# EAGLE design transponder-5.2 (EAGLE 9.6.1)

## Sheet 1 of 7
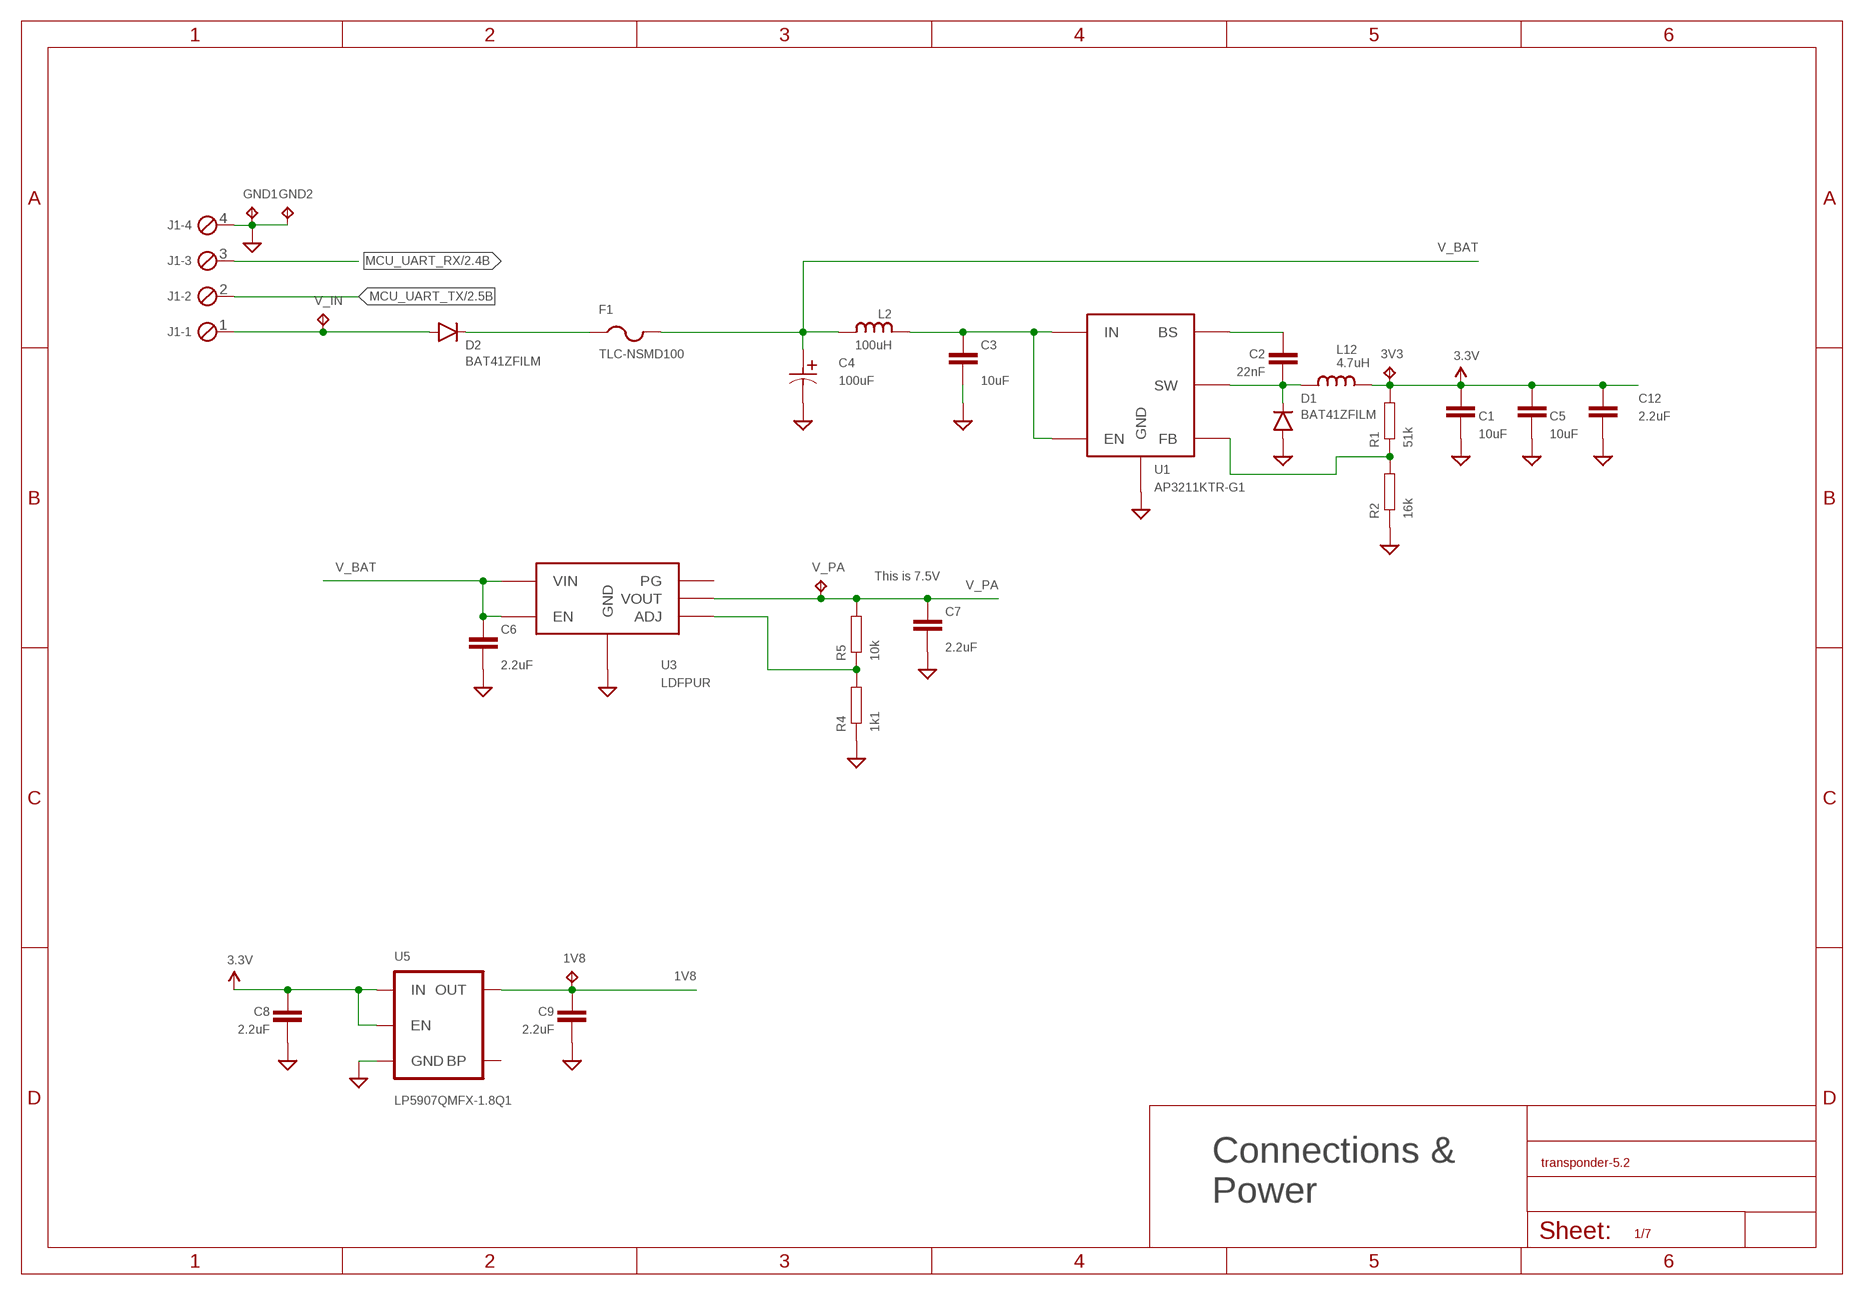
[diagram p0: schematic, sheet 1]

### Parts
1V8  TPTP16R  [TP16R]
3V3  TPTP16R  [TP16R]
C1  10uF  CAP0805  [0805]
C2  22nF  CAP0603-CAP  [0603-CAP]
C3  10uF  CAP0805  [0805]
C4  100uF  UWX1C101MCL1GB  [PCAP_6.3X5.4-ELECT]
C5  10uF  CAP0805  [0805]
C6  2.2uF  CAP0603-CAP  [0603-CAP]
C7  2.2uF  CAP0603-CAP  [0603-CAP]
C8  2.2uF  CAP0603-CAP  [0603-CAP]
C9  2.2uF  CAP0603-CAP  [0603-CAP]
C12  2.2uF  CAP0603-CAP  [0603-CAP]
D1  BAT41ZFILM  DIODESOD123  [SOD-123]
D2  BAT41ZFILM  DIODESOD123  [SOD-123]
F1  TLC-NSMD100  PTCFUSE-1206  [R1206]
GND1  TPTP16R  [TP16R]
GND2  TPTP16R  [TP16R]
J1  MPT4  [4POL254]
L2  100uH  INDUCTOR1206  [1206]
L12  4.7uH  INDUCTOR0805  [0805]
R1  51k  RESISTOR0603-RES  [0603-RES]
R2  16k  RESISTOR0603-RES  [0603-RES]
R4  1k1  RESISTOR0603-RES  [0603-RES]
R5  10k  RESISTOR0603-RES  [0603-RES]
U1  AP3211KTR-G1  AP3211  [SOT23-6]
U3  LDFPUR  LDF  [DFN-6]
U5  LP5907QMFX-1.8Q1  V_REG_LDOSMD  [SOT23-5]
V_IN  TPTP16R  [TP16R]
V_PA  TPTP16R  [TP16R]

### Nets
1V8: 1V8.TP C9.1 U5.5(OUT) ; also sheet 6
3.3V: 3V3.TP C1.1 C5.1 C8.1 C12.1 L12.P$2 R1.2 U5.1(IN) U5.3(EN) ; also sheet 2,4,6,7
GND: C1.2 C3.2 C4.2 C5.2 C6.2 C7.2 C8.2 C9.2 C12.2 D1.A GND1.TP GND2.TP J1.4 R2.1 R4.1 U1.2(GND) U3.P$4(GND) U3.P$7(GND) U5.2(GND) ; also sheet 2,3,4,5,6,7
MCU_UART_RX: J1.3 ; also sheet 2
MCU_UART_TX: J1.2 ; also sheet 2
N$1: C3.1 L2.P$1 U1.4(EN) U1.5(IN)
N$2: C2.2 D1.C L12.P$1 U1.6(SW)
N$4: C2.1 U1.1(BS)
N$5: R1.1 R2.2 U1.3(FB)
N$9: R4.2 R5.1 U3.P$2(ADJ)
N$22: D2.C F1.1
V_BAT: C4.1 C6.1 F1.2 L2.P$2 U3.P$5(EN) U3.P$6(VIN)
V_IN: D2.A J1.1 V_IN.TP
V_PA: C7.1 R5.2 U3.P$1(VOUT) V_PA.TP ; also sheet 5
Unconnected: U3.P$3(PG) U5.4(BP)

### Notes on the sheet
- This is 7.5V
- Connections &
  Power

## Sheet 2 of 7
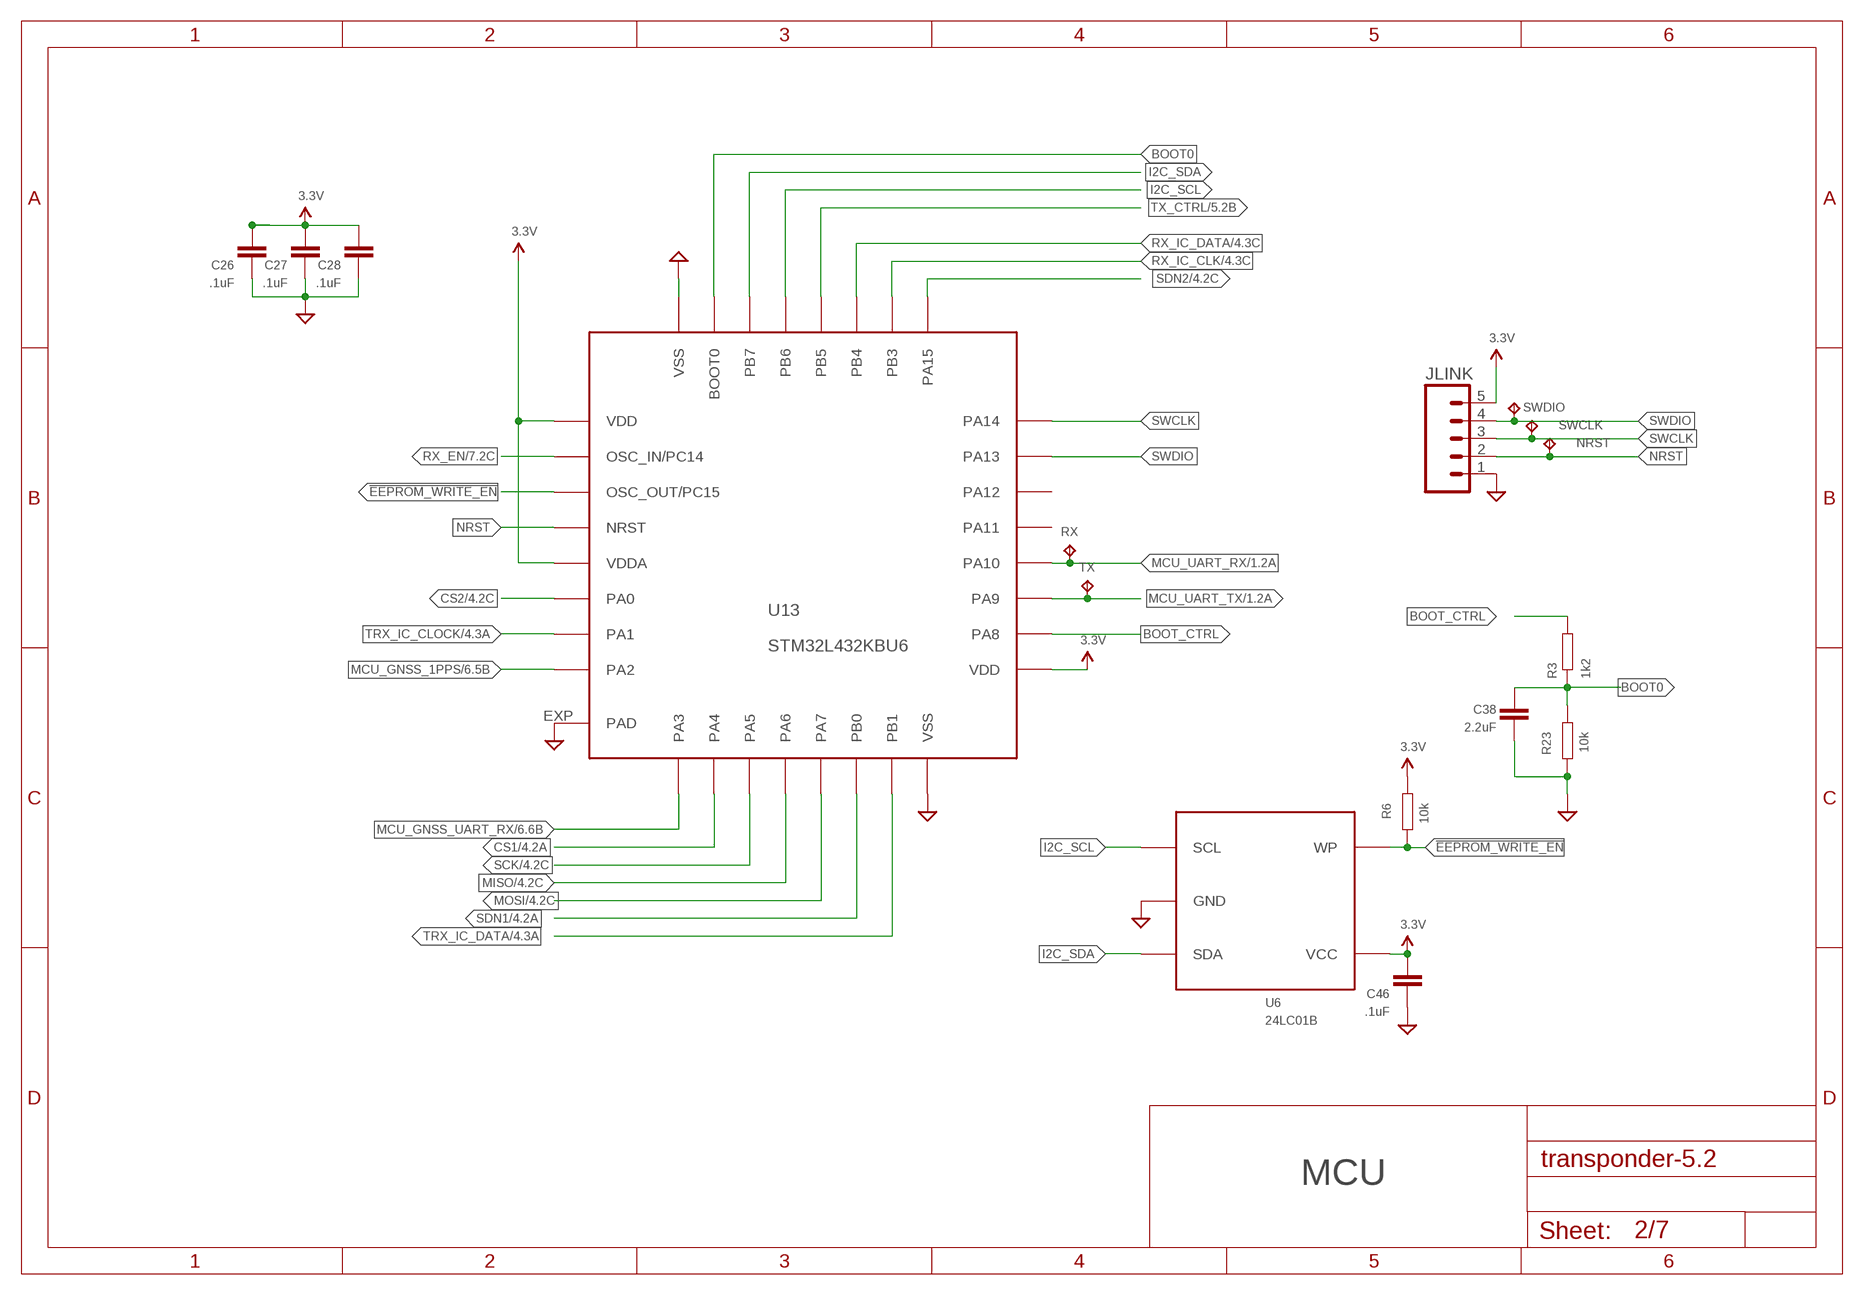
[diagram p1: schematic, sheet 2]

### Parts
C26  .1uF  CAP0603-CAP  [0603-CAP]
C27  .1uF  CAP0603-CAP  [0603-CAP]
C28  .1uF  CAP0603-CAP  [0603-CAP]
C38  2.2uF  CAP0603-CAP  [0603-CAP]
C46  .1uF  CAP0603-CAP  [0603-CAP]
JLINK  M05PTH  [1X05]
NRST  TPTP16R  [TP16R]
R3  1k2  RESISTOR0603-RES  [0603-RES]
R6  10k  RESISTOR0603-RES  [0603-RES]
R23  10k  RESISTOR0603-RES  [0603-RES]
RX  TPTP16R  [TP16R]
SWCLK  TPTP16R  [TP16R]
SWDIO  TPTP16R  [TP16R]
TX  TPTP16R  [TP16R]
U6  24LC01B  [SOT23-5]
U13  STM32L432KBU6  STM32L432KXXX  [QFN32]

### Nets
3.3V: C26.1 C27.1 C28.1 C46.1 JLINK.5 R6.1 U6.4(VCC) U13.1(VDD) U13.5(VDDA) U13.17(VDD) ; also sheet 1,4,6,7
!EEPROM_WRITE_EN: R6.2 U6.5(WP) U13.3(OSC_OUT/PC15)
BOOT0: C38.1 R3.1 R23.1 U13.31(BOOT0)
BOOT_CTRL: R3.2 U13.18(PA8)
CS1: U13.10(PA4) ; also sheet 4
CS2: U13.6(PA0) ; also sheet 4
GND: C26.2 C27.2 C28.2 C38.2 C46.2 JLINK.1 R23.2 U6.2(GND) U13.16(VSS) U13.32(VSS) U13.EXP(PAD) ; also sheet 1,3,4,5,6,7
I2C_SCL: U6.1(SCL) U13.29(PB6)
I2C_SDA: U6.3(SDA) U13.30(PB7)
MCU_GNSS_1PPS: U13.8(PA2) ; also sheet 6
MCU_GNSS_UART_RX: U13.9(PA3) ; also sheet 6
MCU_UART_RX: RX.TP U13.20(PA10) ; also sheet 1
MCU_UART_TX: TX.TP U13.19(PA9) ; also sheet 1
MISO: U13.12(PA6) ; also sheet 4
MOSI: U13.13(PA7) ; also sheet 4
NRST: JLINK.2 NRST.TP U13.4(NRST)
RX_EN: U13.2(OSC_IN/PC14) ; also sheet 7
RX_IC_CLK: U13.26(PB3) ; also sheet 4
RX_IC_DATA: U13.27(PB4) ; also sheet 4
SCK: U13.11(PA5) ; also sheet 4
SDN1: U13.14(PB0) ; also sheet 4
SDN2: U13.25(PA15) ; also sheet 4
SWCLK: JLINK.3 SWCLK.TP U13.24(PA14)
SWDIO: JLINK.4 SWDIO.TP U13.23(PA13)
TRX_IC_CLOCK: U13.7(PA1) ; also sheet 4
TRX_IC_DATA: U13.15(PB1) ; also sheet 4
TX_CTRL: U13.28(PB5) ; also sheet 5
Unconnected: U13.21(PA11) U13.22(PA12)

### Notes on the sheet
- MCU

## Sheet 3 of 7
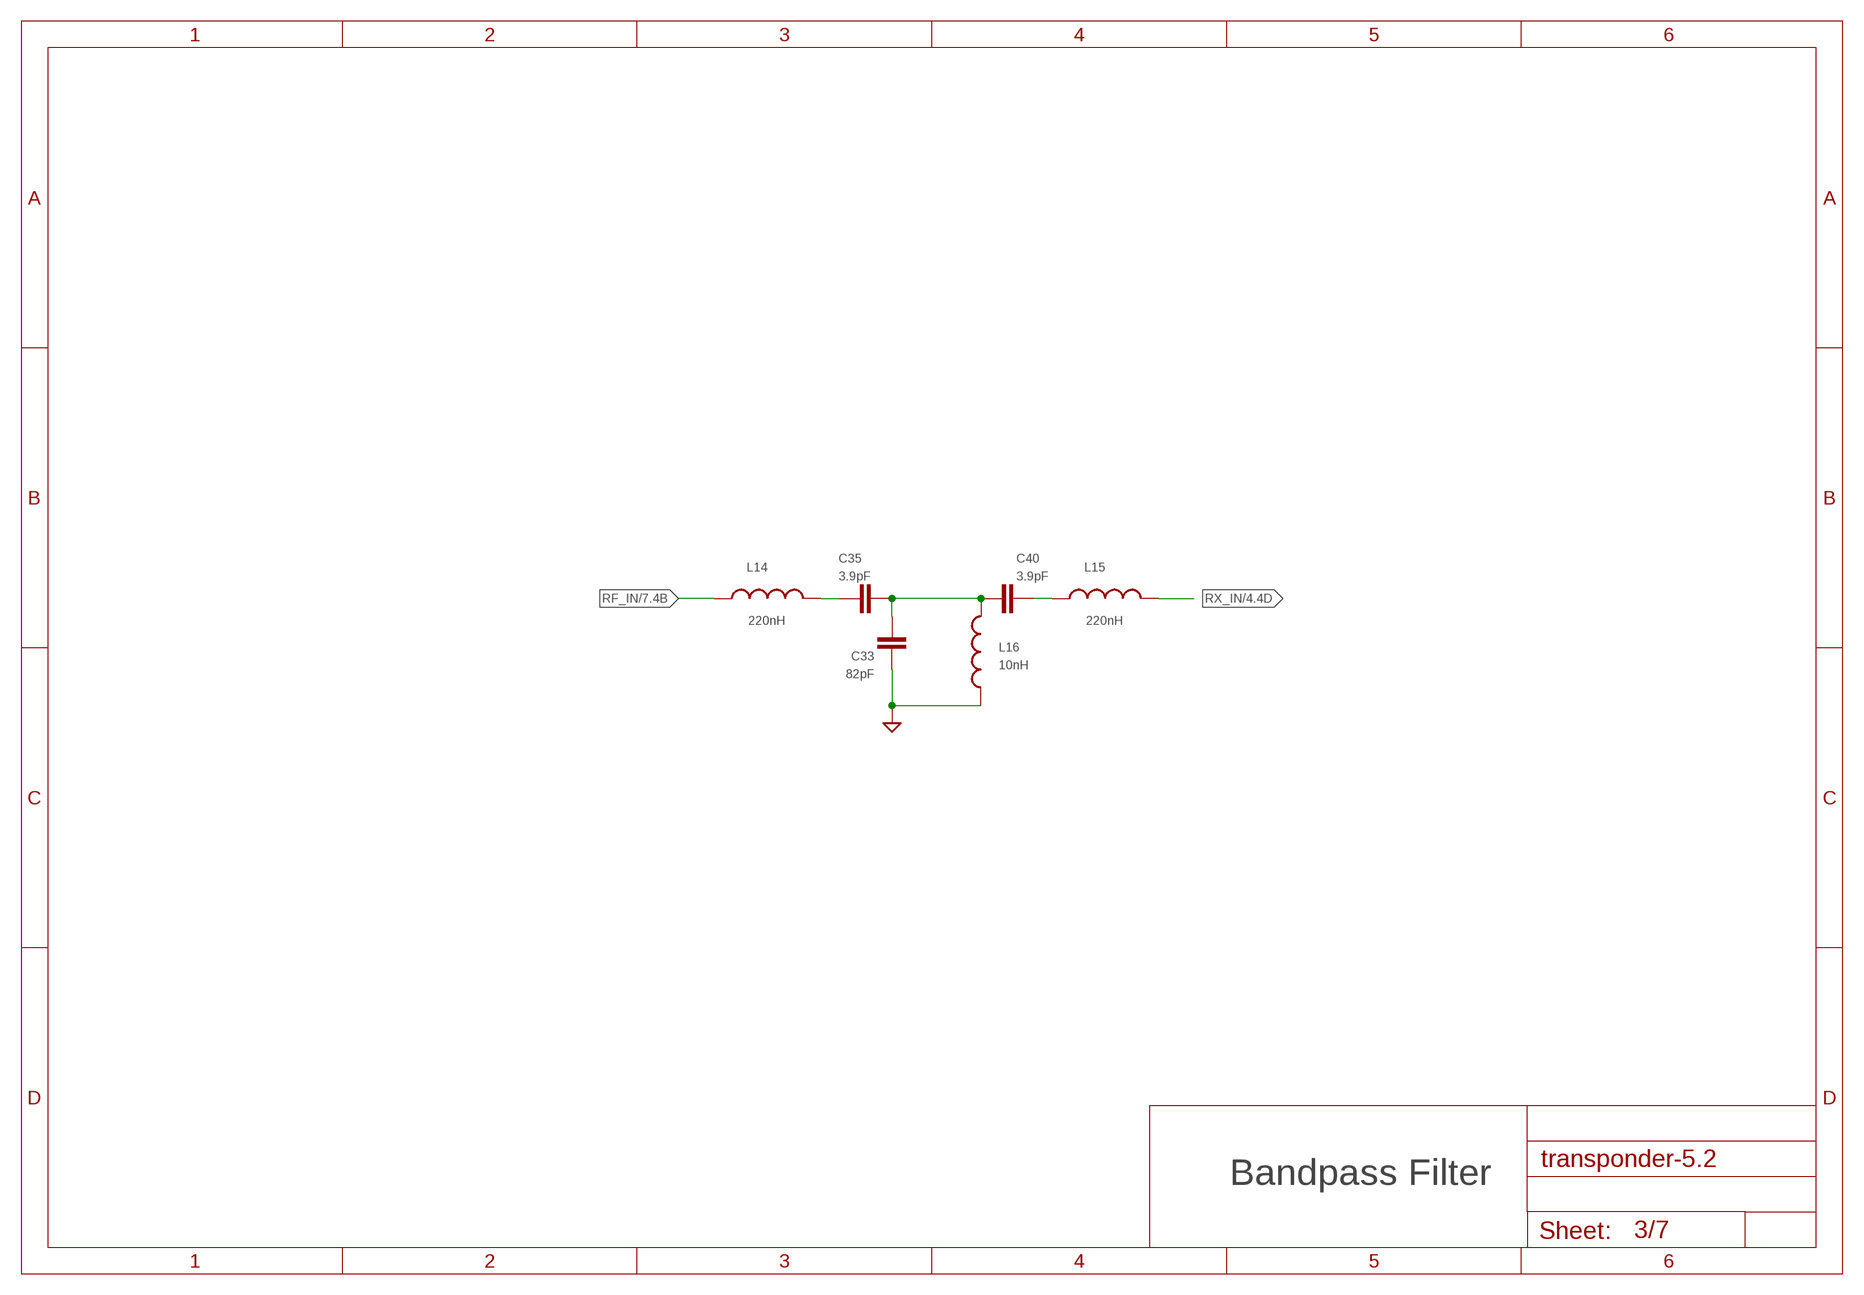
[diagram p2: schematic, sheet 3]

### Parts
C33  82pF  CAP0603-CAP  [0603-CAP]
C35  3.9pF  CAP0603-CAP  [0603-CAP]
C40  3.9pF  CAP0603-CAP  [0603-CAP]
L14  220nH  INDUCTOR0603  [0603]
L15  220nH  INDUCTOR0603  [0603]
L16  10nH  INDUCTOR0603  [0603]

### Nets
GND: C33.1 L16.1 ; also sheet 1,2,4,5,6,7
N$37: C33.2 C35.1 C40.2 L16.2
N$38: C40.1 L15.1
N$39: C35.2 L14.2
RF_IN: L14.1 ; also sheet 7
RX_IN: L15.2 ; also sheet 4

### Notes on the sheet
- Bandpass Filter

## Sheet 4 of 7
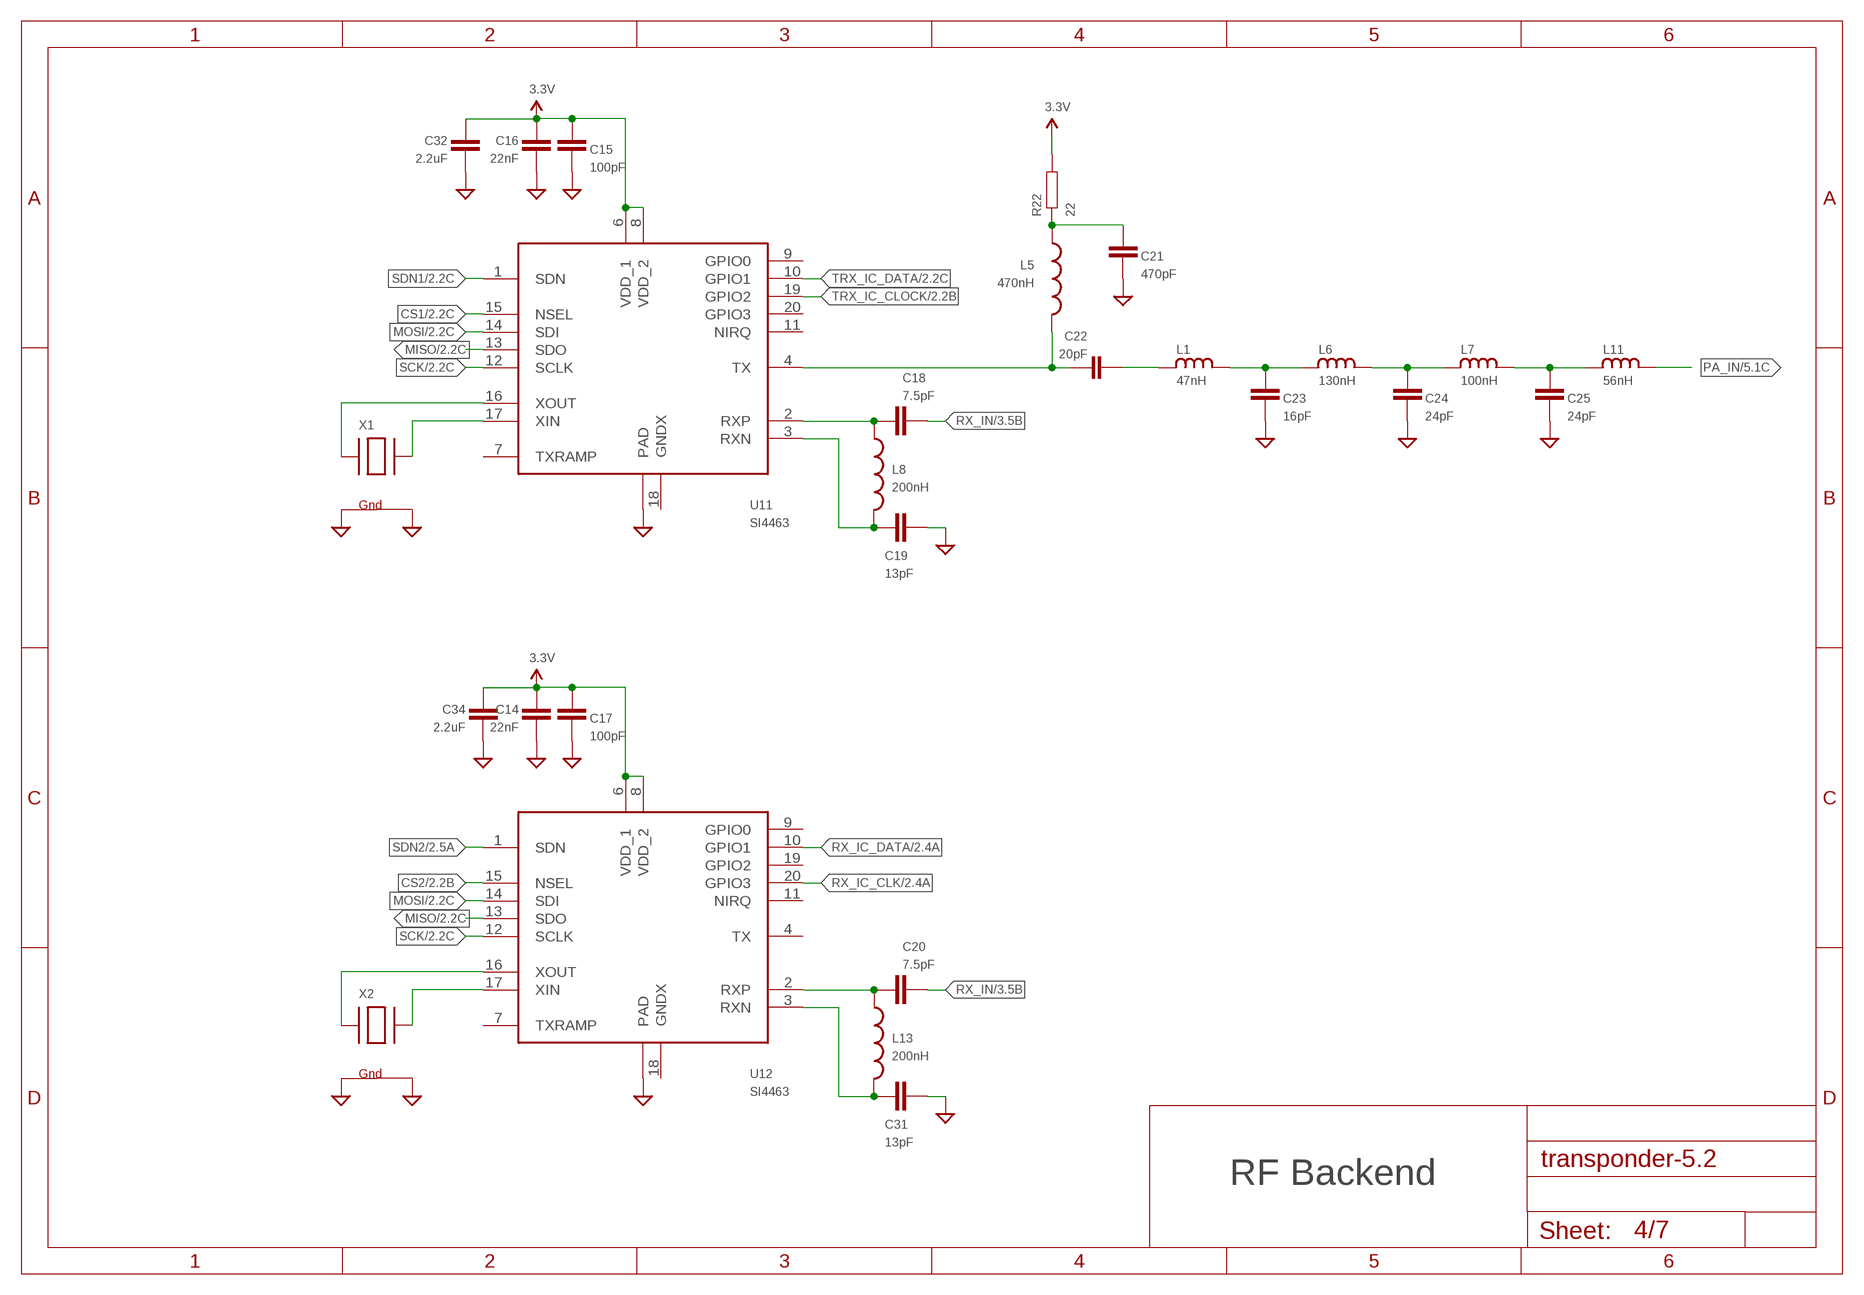
[diagram p3: schematic, sheet 4]

### Parts
C14  22nF  CAP0603-CAP  [0603-CAP]
C15  100pF  CAP0603-CAP  [0603-CAP]
C16  22nF  CAP0603-CAP  [0603-CAP]
C17  100pF  CAP0603-CAP  [0603-CAP]
C18  7.5pF  CAP0603-CAP  [0603-CAP]
C19  13pF  CAP0603-CAP  [0603-CAP]
C20  7.5pF  CAP0603-CAP  [0603-CAP]
C21  470pF  CAP0603-CAP  [0603-CAP]
C22  20pF  CAPACITOR0603  [0603]
C23  16pF  CAP0603-CAP  [0603-CAP]
C24  24pF  CAP0603-CAP  [0603-CAP]
C25  24pF  CAP0603-CAP  [0603-CAP]
C31  13pF  CAP0603-CAP  [0603-CAP]
C32  2.2uF  CAP0603-CAP  [0603-CAP]
C34  2.2uF  CAP0603-CAP  [0603-CAP]
L1  47nH  INDUCTOR0603  [0603]
L5  470nH  INDUCTOR0603  [0603]
L6  130nH  INDUCTOR0603  [0603]
L7  100nH  INDUCTOR0603  [0603]
L8  200nH  INDUCTOR0603  [0603]
L11  56nH  INDUCTOR0603  [0603]
L13  200nH  INDUCTOR0603  [0603]
R22  22  RESISTOR0603-RES  [0603-RES]
U11  SI4463  [SI4463]
U12  SI4463  [SI4463]
X1  XTAL-4-3225  [NX3225]
X2  XTAL-4-3225  [NX3225]

### Nets
3.3V: C14.1 C15.1 C16.1 C17.1 C32.1 C34.1 R22.2 U11.6(VDD_1) U11.8(VDD_2) U12.6(VDD_1) U12.8(VDD_2) ; also sheet 1,2,6,7
CS1: U11.15(NSEL) ; also sheet 2
CS2: U12.15(NSEL) ; also sheet 2
GND: C14.2 C15.2 C16.2 C17.2 C19.1 C21.2 C23.2 C24.2 C25.2 C31.1 C32.2 C34.2 U11.EXP(PAD) U12.EXP(PAD) X1.2(G2) X1.4(G1) X2.2(G2) X2.4(G1) ; also sheet 1,2,3,5,6,7
MISO: U11.13(SDO) U12.13(SDO) ; also sheet 2
MOSI: U11.14(SDI) U12.14(SDI) ; also sheet 2
N$3: C19.2 L8.2 U11.3(RXN)
N$6: C18.1 L8.1 U11.2(RXP)
N$7: C24.1 L6.P$2 L7.P$1
N$11: C25.1 L7.P$2 L11.P$1
N$12: C23.1 L1.P$2 L6.P$1
N$16: U12.16(XOUT) X2.1(X1)
N$17: U12.17(XIN) X2.3(X2)
N$18: U11.16(XOUT) X1.1(X1)
N$19: U11.17(XIN) X1.3(X2)
N$20: C20.1 L13.1 U12.2(RXP)
N$21: C31.2 L13.2 U12.3(RXN)
N$24: C22.P$1 L5.2 U11.4(TX)
N$30: C21.1 L5.1 R22.1
N$31: C22.P$2 L1.P$1
PA_IN: L11.P$2 ; also sheet 5
RX_IC_CLK: U12.20(GPIO3) ; also sheet 2
RX_IC_DATA: U12.10(GPIO1) ; also sheet 2
RX_IN: C18.2 C20.2 ; also sheet 3
SCK: U11.12(SCLK) U12.12(SCLK) ; also sheet 2
SDN1: U11.1(SDN) ; also sheet 2
SDN2: U12.1(SDN) ; also sheet 2
TRX_IC_CLOCK: U11.19(GPIO2) ; also sheet 2
TRX_IC_DATA: U11.10(GPIO1) ; also sheet 2
Unconnected: U11.7(TXRAMP) U11.9(GPIO0) U11.11(NIRQ) U11.18(GNDX) U11.20(GPIO3) U12.4(TX) U12.7(TXRAMP) U12.9(GPIO0) U12.11(NIRQ) U12.18(GNDX) U12.19(GPIO2)

### Notes on the sheet
- RF Backend

## Sheet 5 of 7
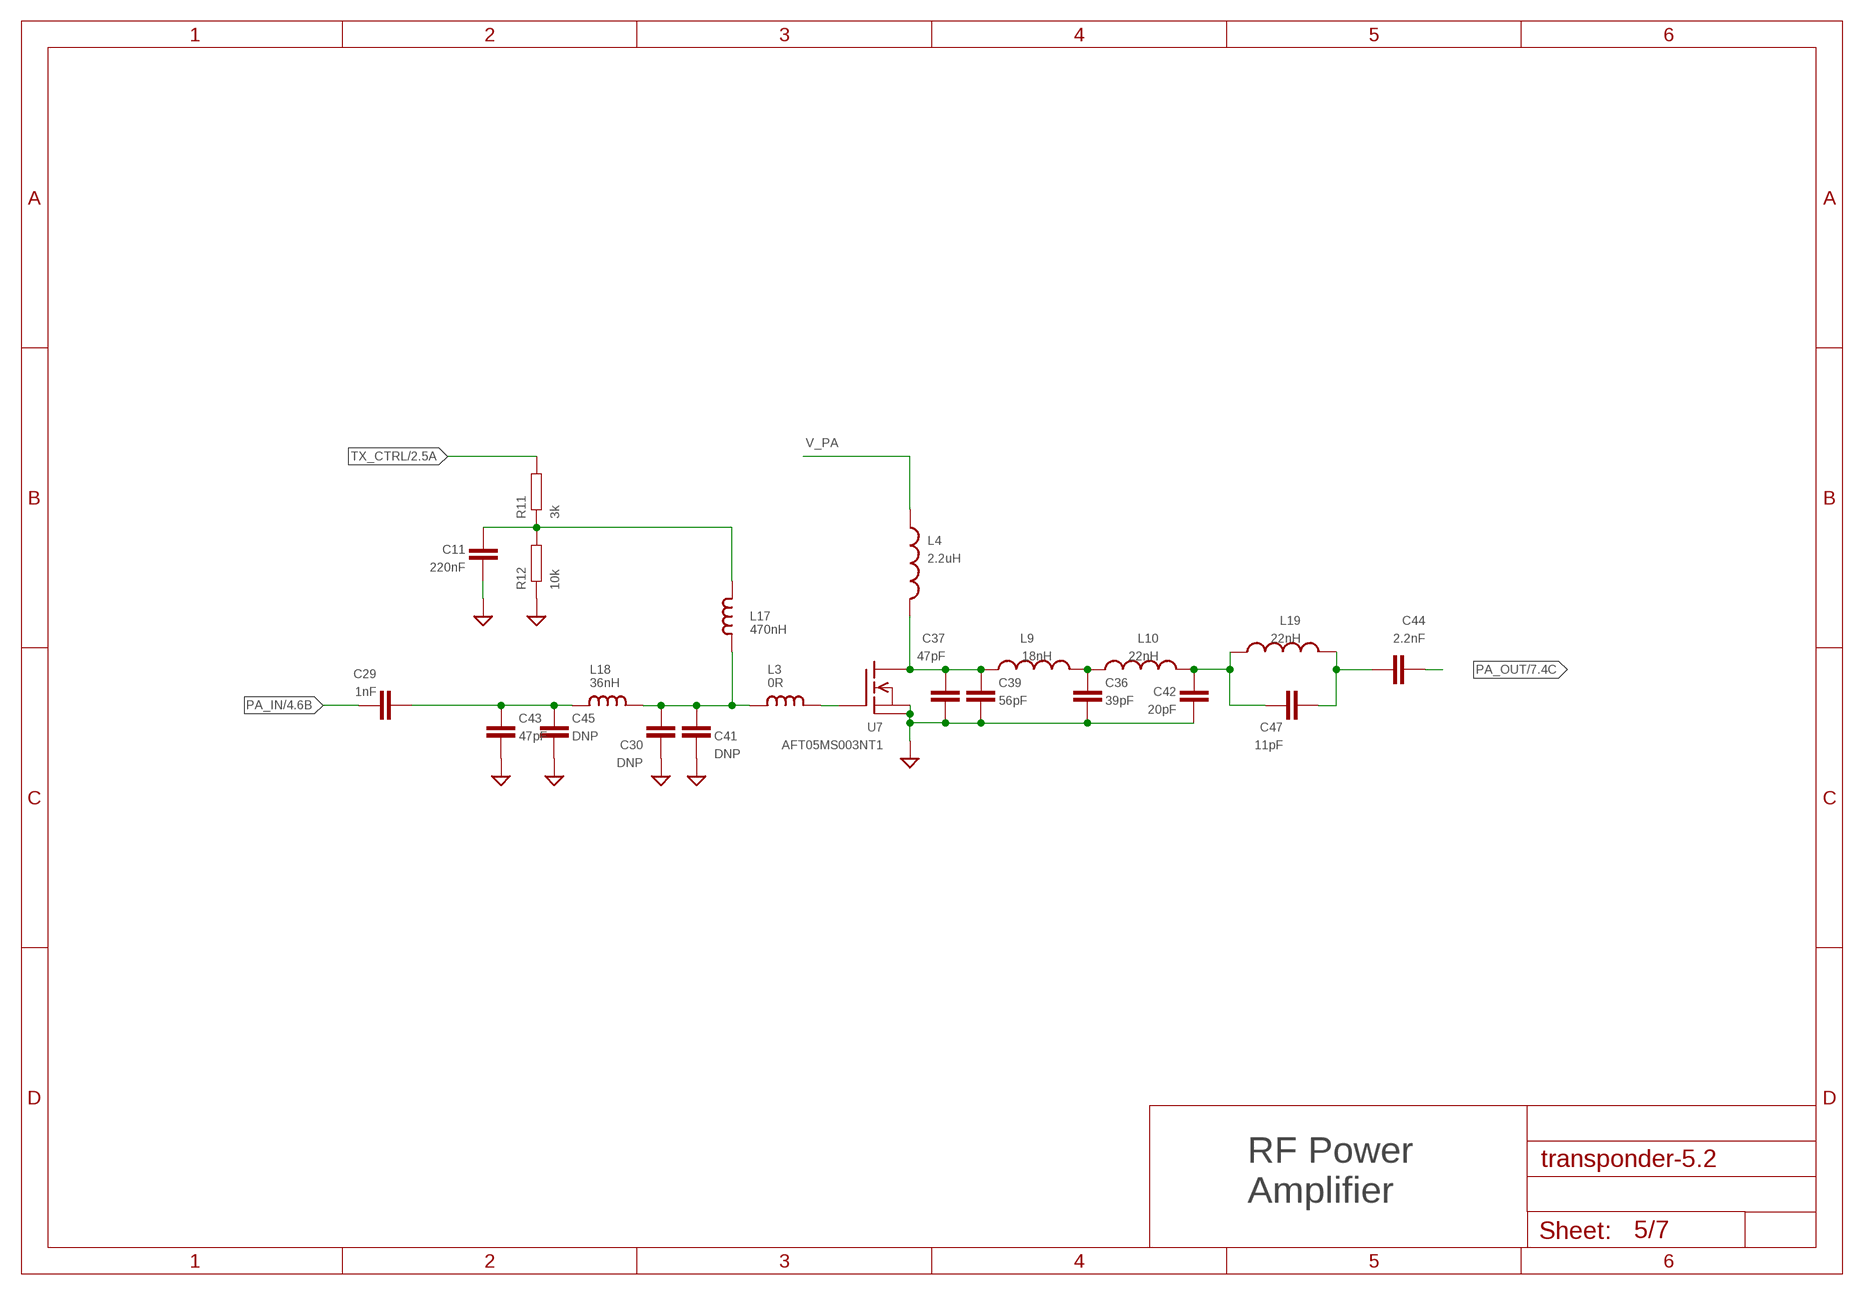
[diagram p4: schematic, sheet 5]

### Parts
C11  220nF  CAP0603-CAP  [0603-CAP]
C29  1nF  CAP0603-CAP  [0603-CAP]
C30  DNP  CAP0603-CAP  [0603-CAP]
C36  39pF  CAP0603-CAP  [0603-CAP]
C37  47pF  CAP0603-CAP  [0603-CAP]
C39  56pF  CAP0603-CAP  [0603-CAP]
C41  DNP  CAP0603-CAP  [0603-CAP]
C42  20pF  CAP0603-CAP  [0603-CAP]
C43  47pF  CAP0603-CAP  [0603-CAP]
C44  2.2nF  CAP0603-CAP  [0603-CAP]
C45  DNP  CAP0603-CAP  [0603-CAP]
C47  11pF  CAP0603-CAP  [0603-CAP]
L3  0R  INDUCTOR0603  [0603]
L4  2.2uH  INDUCTOR0805  [0805]
L9  18nH  INDUCTOR0603  [0603]
L10  22nH  INDUCTOR0603  [0603]
L17  470nH  INDUCTOR0603  [0603]
L18  36nH  INDUCTOR0603  [0603]
L19  22nH  INDUCTOR0603  [0603]
R11  3k  RESISTOR0603-RES  [0603-RES]
R12  10k  RESISTOR0603-RES  [0603-RES]
U7  AFT05MS003NT1  AFT0SMS003N  [SOT-89]

### Nets
GND: C11.2 C30.2 C36.2 C37.2 C39.2 C41.2 C42.2 C43.2 C45.2 R12.1 U7.2(S) U7.2@1(PAD) ; also sheet 1,2,3,4,6,7
N$8: C11.1 L17.P$2 R11.1 R12.2
N$23: C37.1 C39.1 L4.2 L9.1 U7.3(D)
N$26: L3.P$2 U7.1(G)
N$28: C36.1 L9.2 L10.1
N$29: C29.2 C43.1 C45.1 L18.P$1
N$32: C30.1 C41.1 L3.P$1 L17.P$1 L18.P$2
N$34: C44.1 C47.2 L19.2
N$43: C42.1 C47.1 L10.2 L19.1
PA_IN: C29.1 ; also sheet 4
PA_OUT: C44.2 ; also sheet 7
TX_CTRL: R11.2 ; also sheet 2
V_PA: L4.1 ; also sheet 1

### Notes on the sheet
- RF Power
  Amplifier

## Sheet 6 of 7
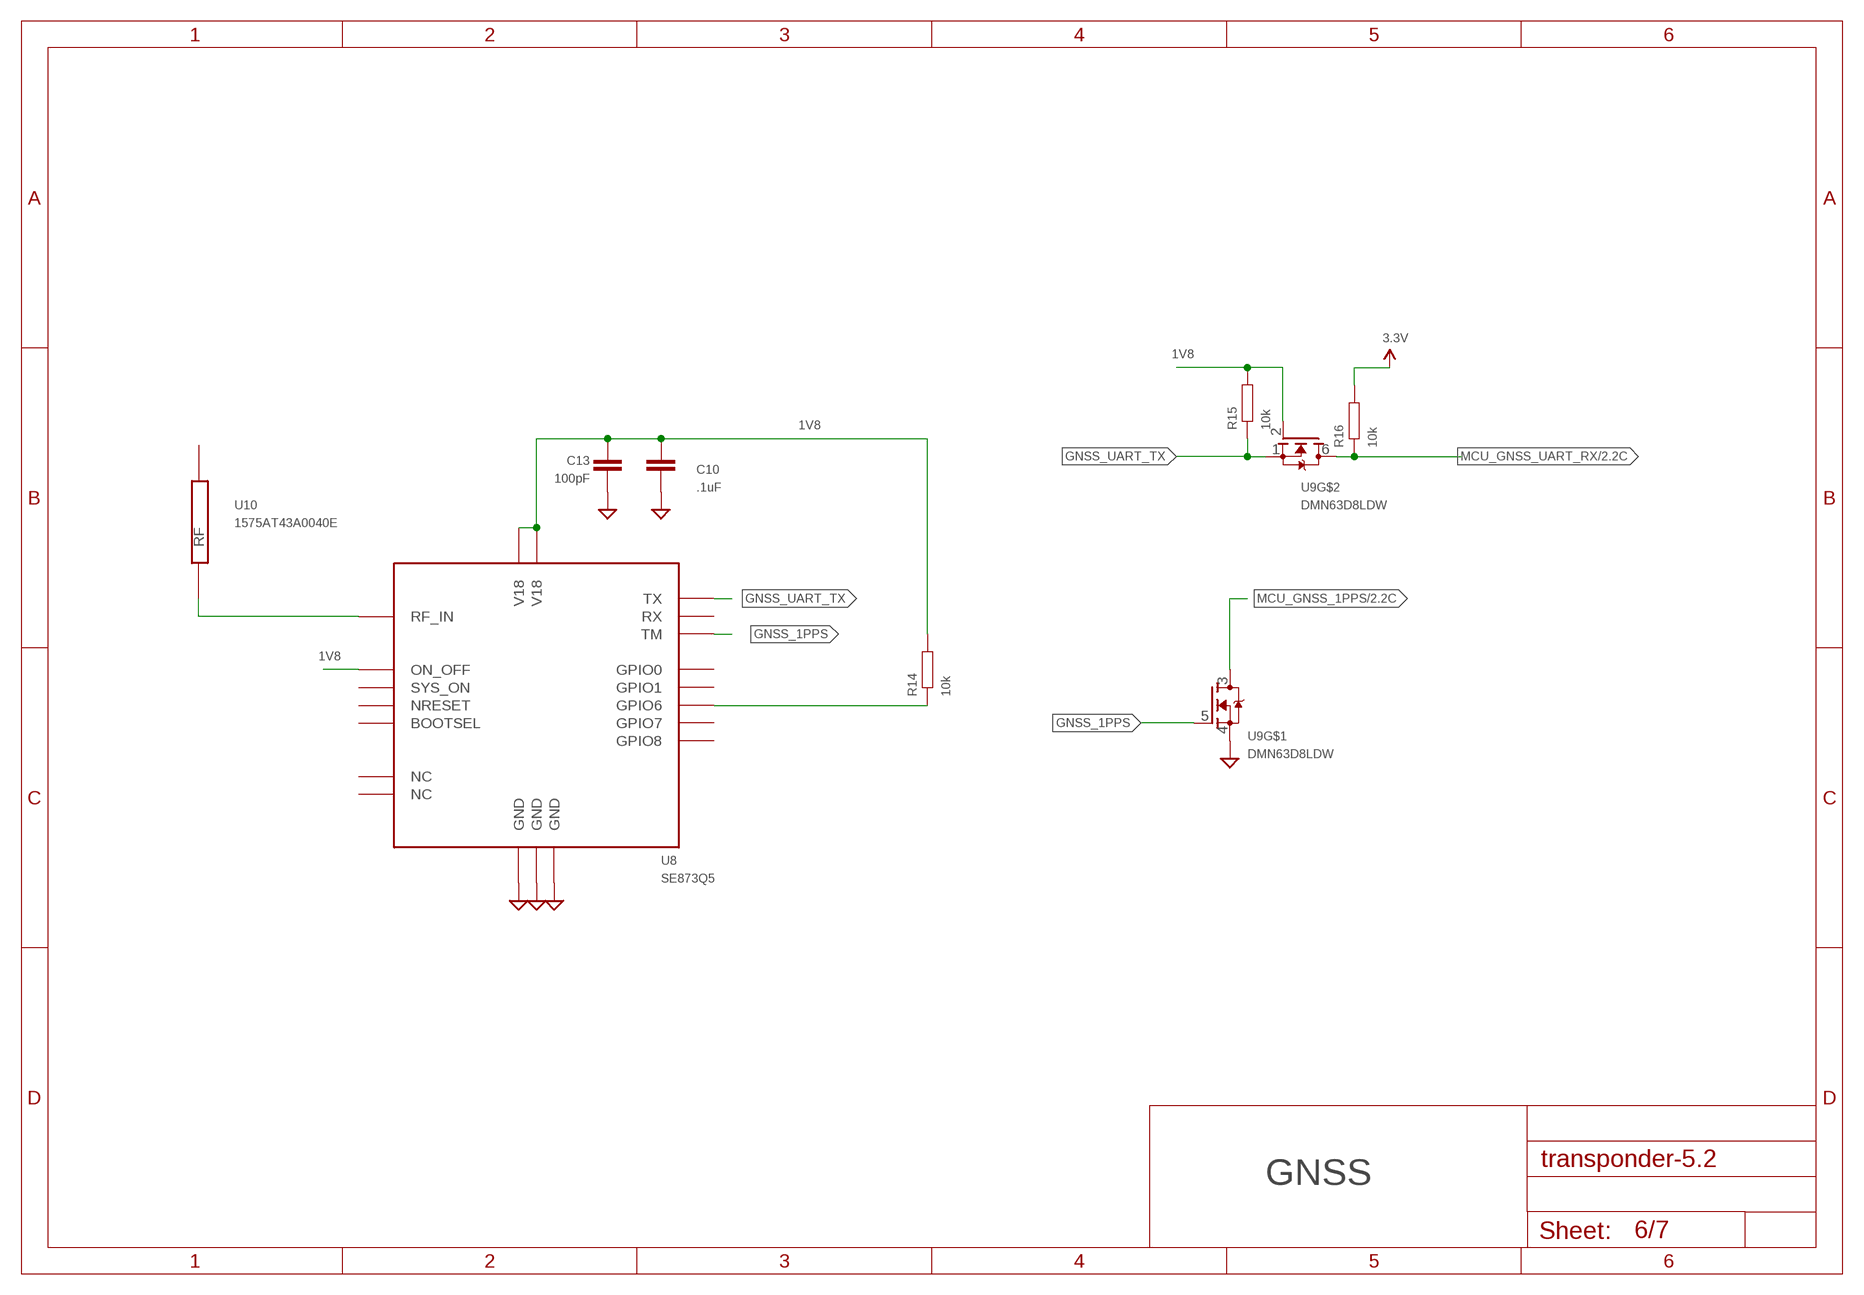
[diagram p5: schematic, sheet 6]

### Parts
C10  .1uF  CAP0603-CAP  [0603-CAP]
C13  100pF  CAP0603-CAP  [0603-CAP]
R14  10k  RESISTOR0603-RES  [0603-RES]
R15  10k  RESISTOR0603-RES  [0603-RES]
R16  10k  RESISTOR0603-RES  [0603-RES]
U8  SE873Q5  SE873  [SE873]
U9  DMN63D8LDW  [SOT363]
U10  1575AT43A0040E  [1575AT43A0040E]

### Nets
1V8: C10.1 C13.1 R14.2 R15.2 U8.P$3(V18) U8.P$6(ON_OFF) U8.P$19(V18) U9.2(G) ; also sheet 1
3.3V: R16.2 ; also sheet 1,2,4,7
GND: C10.2 C13.2 U8.P$2(GND) U8.P$10(GND) U8.P$20(GND) U9.4(S) ; also sheet 1,2,3,4,5,7
GNSS_1PPS: U8.P$11(TM) U9.5(G)
GNSS_UART_TX: R15.1 U8.P$15(TX) U9.1(S)
MCU_GNSS_1PPS: U9.3(D) ; also sheet 2
MCU_GNSS_UART_RX: R16.1 U9.6(D) ; also sheet 2
N$10: U8.P$1(RF_IN) U10.P$1(RF)
N$13: R14.1 U8.P$13(GPIO6)
Unconnected: U8.P$4(NC) U8.P$5(GPIO8) U8.P$7(SYS_ON) U8.P$8(NRESET) U8.P$9(BOOTSEL) U8.P$12(GPIO7) U8.P$14(RX) U8.P$16(NC) U8.P$17(GPIO1) U8.P$18(GPIO0) U10.P$2(PAD)

### Notes on the sheet
- GNSS

## Sheet 7 of 7
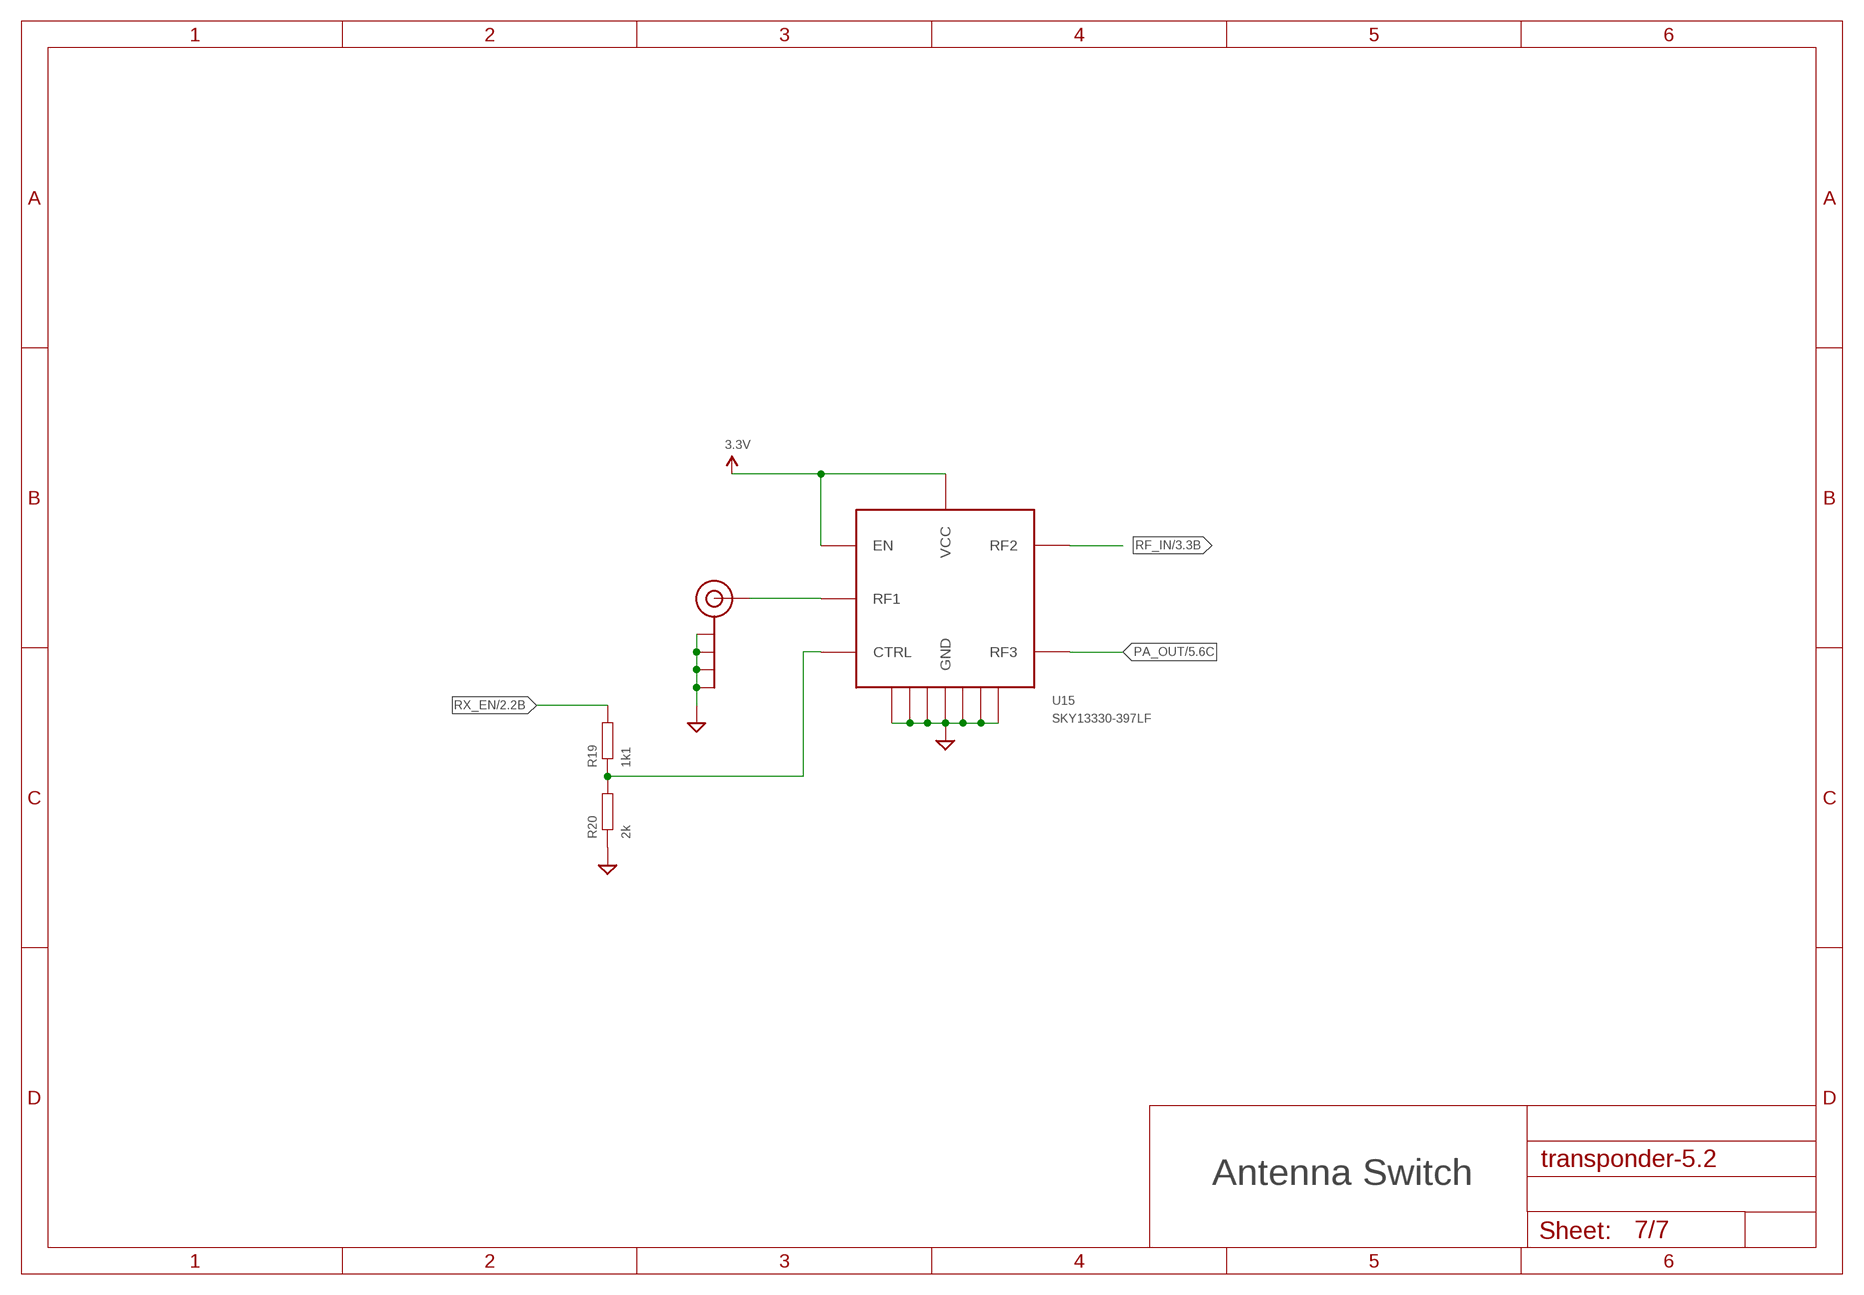
[diagram p6: schematic, sheet 7]

### Parts
J$1  SMA_EDGE  [SMA-EDGE]
R19  1k1  RESISTOR0603-RES  [0603-RES]
R20  2k  RESISTOR0603-RES  [0603-RES]
U15  SKY13330-397LF  SKYWORKS-13330397LF  [QFN12]

### Nets
3.3V: U15.P$8(EN) U15.P$9(VCC) ; also sheet 1,2,4,6
GND: J$1.GND@0(GND) J$1.GND@1(GND) J$1.GND@2(GND) J$1.GND@3(GND) R20.1 U15.P$1(GND) U15.P$3(GND) U15.P$4(GND) U15.P$6(GND) U15.P$10(GND) U15.P$12(GND) U15.P$13(GND) ; also sheet 1,2,3,4,5,6
N$14: R19.1 R20.2 U15.P$7(CTRL)
N$15: J$1.SIG(SIGNAL) U15.P$2(RF1)
PA_OUT: U15.P$5(RF3) ; also sheet 5
RF_IN: U15.P$11(RF2) ; also sheet 3
RX_EN: R19.2 ; also sheet 2

### Notes on the sheet
- Antenna Switch

## Library data of the parts
1V8 3V3 GND1 GND2 NRST RX SWCLK SWDIO TX V_IN V_PA = testpad:TP: Test pad; DNP: T
C1 C3 C5 = SparkFun-Capacitors:CAP: Capacitor Standard 0603 ceramic capacitor, and 0.1" leaded capacitor.; PARTNO: EMK212ABJ106KG-T
C2 C14 C16 = SparkFun-Capacitors:CAP: Capacitor Standard 0603 ceramic capacitor, and 0.1" leaded capacitor.; PARTNO: GRM188R71E223KA01D
C4 = UWX1C101MCL1GB:UWX1C101MCL1GB: 100µF 16V Aluminum Electrolytic Capacitors Radial, Can - SMD 2000 Hrs @ 85°C Check prices <https://snapeda.com/parts/UWX1C101MCL1GB/Nichicon/view-part/?ref=eda>; ARROW_ELECTRONICS-PURCHASE-URL: https://snapeda.com/shop?store=Arrow+Electronics&id=624199; AVAILABILITY: Good; DESCRIPTION: 100µF 16V Aluminum Electrolytic Capacitors Radial, Can - SMD 2000 Hrs @ 85°C; DIGIKEY-PURCHASE-URL: https://snapeda.com/shop?store=DigiKey&id=624199; MF: Nichicon; MOUSER-PURCHASE-URL: https://snapeda.com/shop?store=Mouser&id=624199; MP: UWX1C101MCL1GB; PACKAGE: Radial Nichicon; PARTNO: UWX1C101MCL1GB; PRICE: None
C6-C9 C12 C32 C34 C38 = SparkFun-Capacitors:CAP: Capacitor Standard 0603 ceramic capacitor, and 0.1" leaded capacitor.; PARTNO: EMK107BJ225KA-T
C10 C26-C28 C46 = SparkFun-Capacitors:CAP: Capacitor Standard 0603 ceramic capacitor, and 0.1" leaded capacitor.; PARTNO: EMK107B7104KAHT
C11 C33 C37 C43 = SparkFun-Capacitors:CAP: Capacitor Standard 0603 ceramic capacitor, and 0.1" leaded capacitor.
C13 C15 C17 C30 = SparkFun-Capacitors:CAP: Capacitor Standard 0603 ceramic capacitor, and 0.1" leaded capacitor.; PARTNO: GCM1885C2A101JA16D
C18 C20 = SparkFun-Capacitors:CAP: Capacitor Standard 0603 ceramic capacitor, and 0.1" leaded capacitor.; PARTNO: GRM1885C1H7R5DA01D
C19 C31 = SparkFun-Capacitors:CAP: Capacitor Standard 0603 ceramic capacitor, and 0.1" leaded capacitor.; PARTNO: GRM1885C1H130JA01D
C21 = SparkFun-Capacitors:CAP: Capacitor Standard 0603 ceramic capacitor, and 0.1" leaded capacitor.; PARTNO: GCM1885C2A471JA16J
C22 = MyPassives:CAPACITOR: Standard SMD capacitor; PARTNO: GRM1885C1H200JA01D
C23 = SparkFun-Capacitors:CAP: Capacitor Standard 0603 ceramic capacitor, and 0.1" leaded capacitor.; PARTNO: GCM1885C2A160JA16D
C24 C25 = SparkFun-Capacitors:CAP: Capacitor Standard 0603 ceramic capacitor, and 0.1" leaded capacitor.; PARTNO: GCM1885C2A240JA16D
C29 = SparkFun-Capacitors:CAP: Capacitor Standard 0603 ceramic capacitor, and 0.1" leaded capacitor.; PARTNO: GRM1885C1H102JA01D
C35 C40 = SparkFun-Capacitors:CAP: Capacitor Standard 0603 ceramic capacitor, and 0.1" leaded capacitor.; PARTNO: GCM1885C2A3R9BA16D
C36 = SparkFun-Capacitors:CAP: Capacitor Standard 0603 ceramic capacitor, and 0.1" leaded capacitor.; PARTNO: GRM1885C1H390JA01D
C39 C45 = SparkFun-Capacitors:CAP: Capacitor Standard 0603 ceramic capacitor, and 0.1" leaded capacitor.; PARTNO: GRM1885C1H560JA01D
C41 = SparkFun-Capacitors:CAP: Capacitor Standard 0603 ceramic capacitor, and 0.1" leaded capacitor.; PARTNO: Murata Electronics
C42 = SparkFun-Capacitors:CAP: Capacitor Standard 0603 ceramic capacitor, and 0.1" leaded capacitor.; PARTNO: GRM1885C1H200JA01D
C44 = SparkFun-Capacitors:CAP: Capacitor Standard 0603 ceramic capacitor, and 0.1" leaded capacitor.; PARTNO: GRM1885C1H222JA01J
C47 = SparkFun-Capacitors:CAP: Capacitor Standard 0603 ceramic capacitor, and 0.1" leaded capacitor.; PARTNO: GRM1885C1H110JA01D
D1 D2 = SparkFun-DiscreteSemi:DIODE: Diode These are standard reverse protection diodes and small signal diodes. SMA package can handle up to about 1A. SOD-323 can handle about 200mA. What the SOD-323 package when ordering, there are some mfgs out there that are 5-pin packages.; PARTNO: BAT41ZFILM
F1 = adafruit:PTCFUSE: PTC fuses, resettable thermistors; PARTNO: TLC-NSMD100
J1 = con-phoenix-254:MPT4: PHOENIX CONNECTOR; DNP: T; OC_FARNELL: unknown; OC_NEWARK: unknown
J$1 = SparkFun-Connectors:SMA_EDGE: SMA Antenna Connector End launch SMA connector. The paste layer has been removed so that the connector can be hand soldered onto the board after reflow.; DNP: T
JLINK = SparkFun-Connectors:M05: Header 5 Standard 5-pin 0.1" header. Use with straight break away headers (SKU : PRT-00116), right angle break away headers (PRT-00553), swiss pins (PRT-00743), machine pins (PRT-00117), and female headers (PRT-00115). Molex polarized connector foot print use with SKU : PRT-08230 with associated crimp pins and housings.; DNP: T
L1 = MyPassives:INDUCTOR: Standard SMD inductor; PARTNO: LQW18AS47NG00D
L2 = MyPassives:INDUCTOR: Standard SMD inductor; PARTNO: CBC3225T101KRV
L3 = MyPassives:INDUCTOR: Standard SMD inductor; PARTNO: LQW18AN11NJ00D
L4 = SparkFun-Passives:INDUCTOR: Inductors Basic Inductor/Choke - 0603 and 1206. Footprints are not proven and vary greatly between part numbers. INDUCTOR POWER 3.3UH 4.0A SMD 0.197" L x 0.197" W x 0.177" H (5.00mm x 5.00mm x 4.50mm); PARTNO: BRC2012T2R2MD
L5 = SparkFun-Passives:INDUCTOR: Inductors Basic Inductor/Choke - 0603 and 1206. Footprints are not proven and vary greatly between part numbers. INDUCTOR POWER 3.3UH 4.0A SMD 0.197" L x 0.197" W x 0.177" H (5.00mm x 5.00mm x 4.50mm); PARTNO: HK1608R47J-T
L6 = MyPassives:INDUCTOR: Standard SMD inductor; PARTNO: LQW18ANR13G00D
L7 = MyPassives:INDUCTOR: Standard SMD inductor; PARTNO: LQW18ANR10G00D
L8 L13 = SparkFun-Passives:INDUCTOR: Inductors Basic Inductor/Choke - 0603 and 1206. Footprints are not proven and vary greatly between part numbers. INDUCTOR POWER 3.3UH 4.0A SMD 0.197" L x 0.197" W x 0.177" H (5.00mm x 5.00mm x 4.50mm); PARTNO: LQW18ANR20J00D
L9 = SparkFun-Passives:INDUCTOR: Inductors Basic Inductor/Choke - 0603 and 1206. Footprints are not proven and vary greatly between part numbers. INDUCTOR POWER 3.3UH 4.0A SMD 0.197" L x 0.197" W x 0.177" H (5.00mm x 5.00mm x 4.50mm); PARTNO: LQW18AN18NG00D
L10 L19 = SparkFun-Passives:INDUCTOR: Inductors Basic Inductor/Choke - 0603 and 1206. Footprints are not proven and vary greatly between part numbers. INDUCTOR POWER 3.3UH 4.0A SMD 0.197" L x 0.197" W x 0.177" H (5.00mm x 5.00mm x 4.50mm); PARTNO: LQW18AN22NJ00D
L11 = MyPassives:INDUCTOR: Standard SMD inductor; PARTNO: LQW18AN56NG00D
L12 = MyPassives:INDUCTOR: Standard SMD inductor; PARTNO: MLZ2012M4R7WT000
L14 L15 = SparkFun-Passives:INDUCTOR: Inductors Basic Inductor/Choke - 0603 and 1206. Footprints are not proven and vary greatly between part numbers. INDUCTOR POWER 3.3UH 4.0A SMD 0.197" L x 0.197" W x 0.177" H (5.00mm x 5.00mm x 4.50mm)
L16 = SparkFun-Passives:INDUCTOR: Inductors Basic Inductor/Choke - 0603 and 1206. Footprints are not proven and vary greatly between part numbers. INDUCTOR POWER 3.3UH 4.0A SMD 0.197" L x 0.197" W x 0.177" H (5.00mm x 5.00mm x 4.50mm); PARTNO: LQW18AS10NJ0CD
L17 = MyPassives:INDUCTOR: Standard SMD inductor; PARTNO: HK1608R47J-T
L18 = MyPassives:INDUCTOR: Standard SMD inductor
R1 = SparkFun-Passives:RESISTOR: Resistor Basic schematic elements and footprints for 0603, 1206, and PTH resistors.; PARTNO: RC0603JR-0751KL
R2 = SparkFun-Passives:RESISTOR: Resistor Basic schematic elements and footprints for 0603, 1206, and PTH resistors.; PARTNO: RC0603FR-1016KL
R3 = SparkFun-Passives:RESISTOR: Resistor Basic schematic elements and footprints for 0603, 1206, and PTH resistors.; PARTNO: RC0603JR-071K2L
R4 = SparkFun-Passives:RESISTOR: Resistor Basic schematic elements and footprints for 0603, 1206, and PTH resistors.; PARTNO: RC0603JR-071K1L
R5 R6 R12 R14-R16 R23 = SparkFun-Passives:RESISTOR: Resistor Basic schematic elements and footprints for 0603, 1206, and PTH resistors.; PARTNO: RC0603JR-0710KL
R11 R19 = SparkFun-Passives:RESISTOR: Resistor Basic schematic elements and footprints for 0603, 1206, and PTH resistors.
R20 = SparkFun-Passives:RESISTOR: Resistor Basic schematic elements and footprints for 0603, 1206, and PTH resistors.; PARTNO: RC0603FR-072KL
R22 = SparkFun-Passives:RESISTOR: Resistor Basic schematic elements and footprints for 0603, 1206, and PTH resistors.; PARTNO: RC0603JR-0722RL
U1 = diodesinc:AP3211; PARTNO: AP3211KTR-G1
U3 = st-power:LDF: Low Noise Adjustable LDO (1A max); PARTNO: LDFPUR
U5 = SparkFun-PowerIC:V_REG_LDO: Voltage Regulator LDO Standard 150mA LDO voltage regulator in SOT-23 layout. Micrel part MIC5205. BP (by-pass) pin is used to lower output noise with 470pF cap.; PARTNO: LP5907QMFX-1.8Q1
U6 = eeprom:24LC01B: 1KB I2C EEPROM; PARTNO: 24LC01BT-I/OT
U7 = nxp:AFT0SMS003N; PARTNO: AFT05MS003NT1
U8 = telit:SE873: Telit SE873 GNSS Receiver; PARTNO: SE873Q5
U9 = diodesinc:DMN63D8LDW: Dual N-Channel MOSFET; PARTNO: DMN63D8LDW
U10 = johanson-technology:1575AT43A0040E: SMD Ceramic GNSS Antenna; PARTNO: 1575AT43A0040E
U11 U12 = EZRadioPRO:SI4463; PARTNO: SI4463-C2A-GMR
U13 = stm32:STM32L432KXXX; PARTNO: STM32L431KBU6
U15 = skyworks:SKYWORKS-13330397LF: SP2T RF Switch; PARTNO: SKY13330-397LF
X1 X2 = adafruit:XTAL-4: Classic 4-pin 3.2 x 2.5mm crystal; PARTNO: CX3225SB30000D0FPLCC

## Board
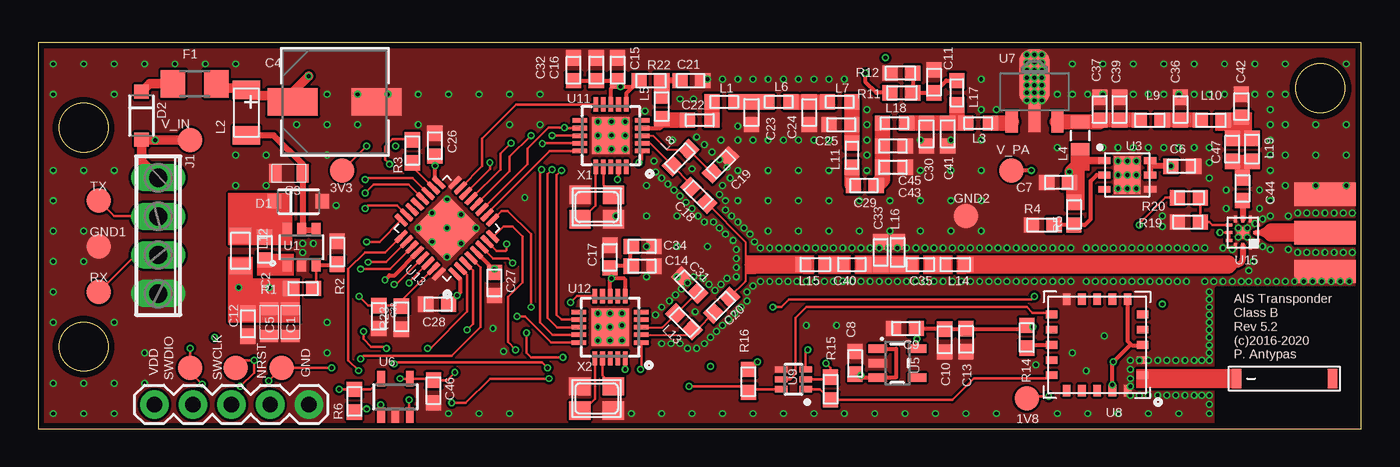
[diagram p7: board, top side]
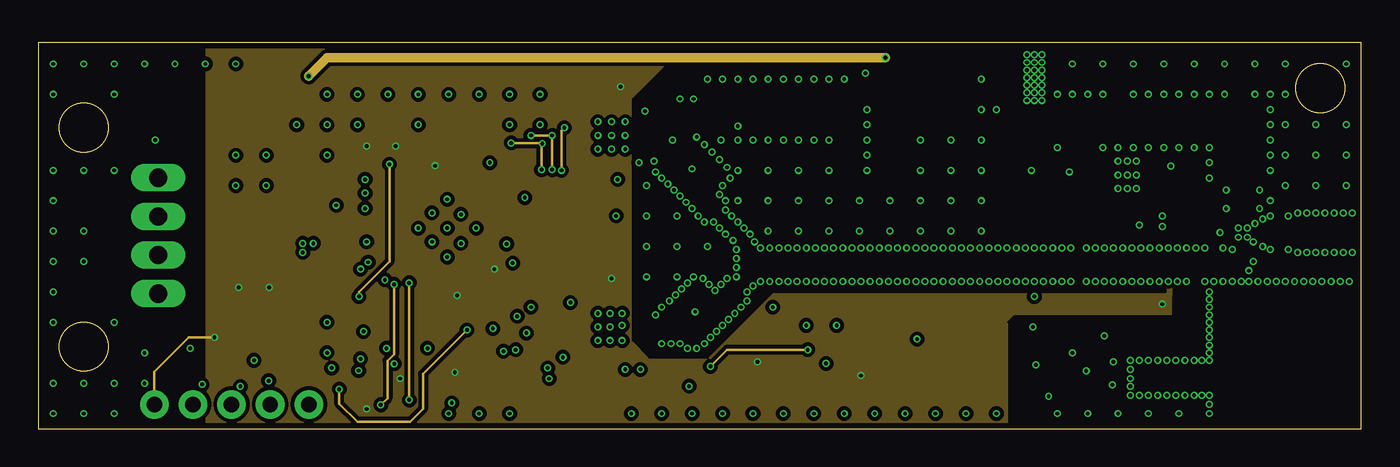
[diagram p8: board, inner layer Layer2]
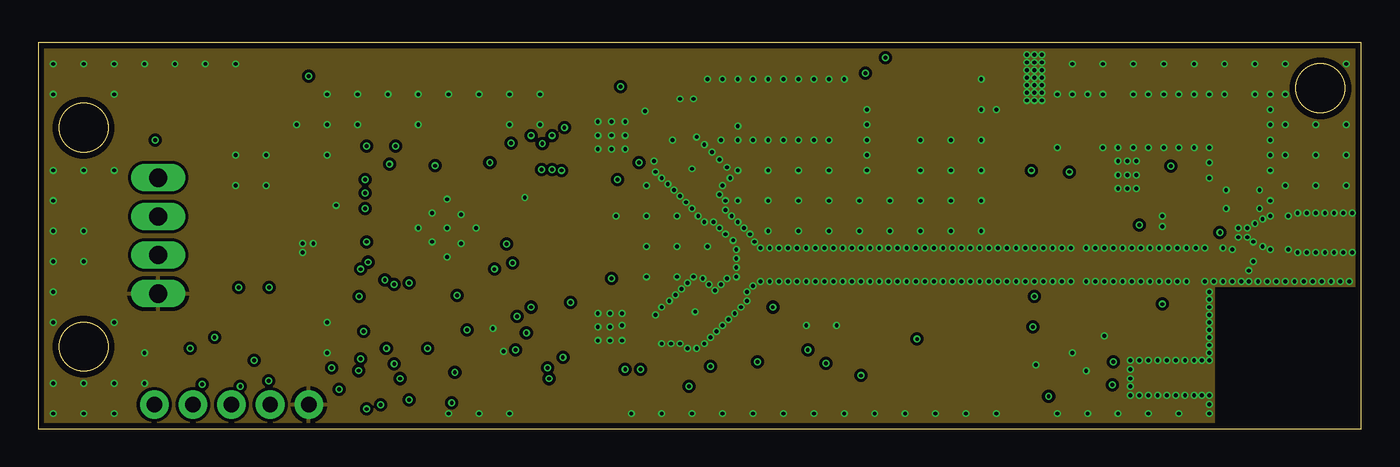
[diagram p9: board, inner layer Layer3]
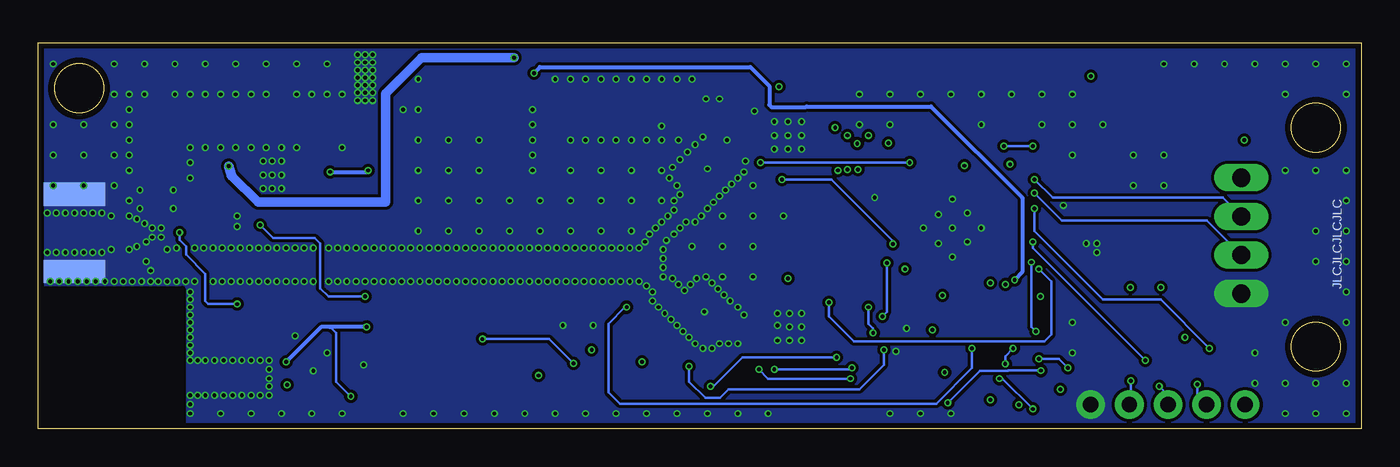
[diagram p10: board, bottom side, seen from below]

Size 87 x 25.4 mm. Coordinates in mm from the lower left corner, seen from the top.
Outline: 0,0 87,0 87,25.4 0,25.4 0,0
Outline: circle at 3,19.8 radius 1.6
Outline: circle at 3,5.4 radius 1.6
Outline: circle at 84.3,22.4 radius 1.6
Copper layers (1+2*15+16): Top 0.035mm / dielectric 0.17mm / Layer2 0.018mm / dielectric 1.2mm / Layer3 0.018mm / dielectric 0.17mm / Bottom 0.035mm
Design rules "default *": minimum track width 5mil, minimum drill 10mil, track to track 6mil, track to pad 6mil, pad to pad 6mil, via to via 6mil, smd to smd 0mil, copper to edge 15mil, drill to drill 6mil, minimum pad ring 4mil, minimum via ring 4mil, stop-mask expansion 0mil, vias tented up to drill 20mil, thermal gap 10mil
tRestrict: area 77.5,0 to 87,9.2
bRestrict: area 77.5,0 to 87,9.2

### Footprints (pad centres in the part's own frame; a part is rotated, then mirrored left to right if it is on the bottom)
TP16R = smd 1.6 x 1.6: TP 0,0
0805 = smd 0.8 x 1.2: 1 -0.9,0; 2 0.9,0
0603-CAP = smd 1 x 1: 1 -0.7,0; 2 0.8,0
PCAP_6.3X5.4-ELECT = smd 3.302 x 1.803: 1 -2.756,0; 2 2.756,0
0603 = smd 1 x 1: P$1 -0.8,0; P$2 0.8,0
SOD-123 = smd 0.9 x 0.95: A 1.575,0; C -1.575,0
R1206 = smd 1.6 x 1.803: 1 -1.422,0; 2 1.422,0
4POL254 = drill 1.2 long: 1 -3.81,0; 2 -1.27,0; 3 1.27,0; 4 3.81,0
SMA-EDGE = smd 1.524 x 4.064: GND@0 0,0; GND@1 5.08,0; SIG 2.54,0 | smd 1.524 x 4.064 bottom: GND@2 0,0; GND@3 5.08,0
1X05 = drill 1.016 pad 1.88: 1 0,0; 2 2.54,0; 3 5.08,0; 4 7.62,0; 5 10.16,0
1206 = smd 1.2 x 1.8: P$1 -1.5,0; P$2 1.5,0
0603' = smd 1 x 1: 1 -0.7,0; 2 0.8,0
0805' = smd 1 x 1.4: P$1 -1,0; P$2 1,0
0603-RES = smd 1 x 1: 1 -0.7,0; 2 0.8,0
SOT23-6 = smd 0.6 x 0.9: 1 -0.95,-1.15; 2 0,-1.15; 3 0.95,-1.15; 4 0.95,1.15; 5 0,1.15; 6 -0.95,1.15
DFN-6 = smd 0.8 x 0.45: P$1 -1.5,0.95; P$2 -1.5,0; P$3 -1.5,-0.95; P$4 1.5,-0.95; P$5 1.5,0; P$6 1.5,0.95 | smd 1.75 x 2.5: P$7 0,0
SOT23-5 = smd 0.55 x 1.2: 1 -0.95,-1.3; 2 0,-1.3; 3 0.95,-1.3; 4 0.95,1.3; 5 -0.95,1.3
SOT23-5' = smd 0.5 x 1: 1 -0.95,-1.2; 2 0,-1.2; 3 0.95,-1.2; 4 0.95,1.2; 5 -0.95,1.2
SOT-89 = smd 0.8 x 1.4: 1 -1.499,-1.981; 3 1.499,-1.981 | smd 0.8 x 1.9: 2 0,-1.727 | smd 2.032 x 3.65: 2@1 0,0.94
SE873 = smd 0.75 x 0.5: P$1 -3,2; P$2 -3,1; P$3 -3,0; P$4 -3,-1; P$5 -3,-2; P$11 3,-2; P$12 3,-1; P$13 3,0; P$14 3,1; P$15 3,2 | smd 0.5 x 0.75: P$6 -2,-3; P$7 -1,-3; P$8 0,-3; P$9 1,-3; P$10 2,-3; P$16 2,3; P$17 1,3; P$18 0,3; P$19 -1,3; P$20 -2,3
SOT363 = smd 0.4 x 0.8: 1 -0.65,-0.8; 2 0,-0.8; 3 0.65,-0.8; 4 0.65,0.8; 5 0,0.8; 6 -0.65,0.8
1575AT43A0040E = smd 0.635 x 1.27: P$1 -3.2,0; P$2 3.1,0
SI4463 = smd 0.95 x 0.3: 1 -2.05,1; 2 -2.05,0.5; 3 -2.05,0; 4 -2.05,-0.5; 5 -2.05,-1; 11 2.05,-1; 12 2.05,-0.5; 13 2.05,0; 14 2.05,0.5; 15 2.05,1 | smd 0.3 x 0.95: 6 -1,-2.05; 7 -0.5,-2.05; 8 0,-2.05; 9 0.5,-2.05; 10 1,-2.05; 16 1,2.05; 17 0.5,2.05; 18 0,2.05; 19 -0.5,2.05; 20 -1,2.05 | smd 2.45 x 2.45: EXP 0,0
QFN32 = smd 1 x 0.3: 1 -2.5,1.75; 2 -2.5,1.25; 3 -2.5,0.75; 4 -2.5,0.25; 5 -2.5,-0.25; 6 -2.5,-0.75; 7 -2.5,-1.25; 8 -2.5,-1.75; 17 2.5,-1.75; 18 2.5,-1.25; 19 2.5,-0.75; 20 2.5,-0.25; 21 2.5,0.25; 22 2.5,0.75; 23 2.5,1.25; 24 2.5,1.75 | smd 0.3 x 1: 9 -1.75,-2.5; 10 -1.25,-2.5; 11 -0.75,-2.5; 12 -0.25,-2.5; 13 0.25,-2.5; 14 0.75,-2.5; 15 1.25,-2.5; 16 1.75,-2.5; 25 1.75,2.5; 26 1.25,2.5; 27 0.75,2.5; 28 0.25,2.5; 29 -0.25,2.5; 30 -0.75,2.5; 31 -1.25,2.5; 32 -1.75,2.5 | smd 3.2 x 3.2: EXP 0,0
QFN12 = smd 0.44 x 0.2: P$1 -0.9,0.5; P$2 -0.9,0; P$3 -0.9,-0.5; P$7 0.9,-0.5; P$8 0.9,0; P$9 0.9,0.5 | smd 0.2 x 0.44: P$4 -0.5,-0.9; P$5 0,-0.9; P$6 0.5,-0.9; P$10 0.5,0.9; P$11 0,0.9; P$12 -0.5,0.9 | smd 0.76 x 0.76: P$13 0,0
NX3225 = smd 1.4 x 1.2: 1 -1.1,-0.8; 2 1.1,-0.8; 3 1.1,0.8; 4 -1.1,0.8

### Placement (x,y rotation side)
1V8  65,2 0 top
3V3  20,17 0 top
C1  16.59,7 270 top
C2  14.9,11.8 90 top
C3  16.5,16.8 180 top
C4  19.5,21.5 0 top
C5  15.2,7 270 top
C6  75.16,17.27 0 top
C7  67.1,16.2 180 top
C8  53.71,4.29 90 top
C9  57.04,6.6 180 top
C10  59.6,5.85 270 top
C11  58.9,22.8 90 top
C12  13.8,6.9 270 top
C13  61,5.88 270 top
C14  39.7,10.7 0 top
C15  38.1,23.6 90 top
C16  36.7,23.6 90 top
C17  37.6,11.28 90 top
C18  43.4,15.4 315 top
C19  44.9,17.4 225 top
C20  44.9,8.1 45 top
C21  42.9,22.9 0 top
C22  43.5,20.3 0 top
C23  46.9,20.8 270 top
C24  50.7,20.8 270 top
C25  52.8,20 180 top
C26  26.09,18.63 90 top
C27  30.01,9.58 270 top
C28  26.29,8.19 180 top
C29  54.3,16 0 top
C30  58.4,19.4 270 top
C31  42.8,9.5 315 top
C32  35.2,23.6 90 top
C33  55.4,11.6 270 top
C34  39.7,12 0 top
C35  58,10.8 0 top
C36  75.1,21 90 top
C37  69.8,21 90 top
C38  22.4,7.4 270 top
C39  71.1,21 90 top
C40  53.5,10.8 0 top
C41  59.8,19.4 270 top
C42  79.1,21.2 90 top
C43  56.2,17.2 0 top
C44  79.17,15.81 270 top
C45  56.2,18.6 0 top
C46  26,2.5 270 top
C47  78.5,18.4 270 top
D1  17.12,14.95 0 top
D2  6.8,20.6 270 top
F1  10.3,22.7 0 top
GND1  4,12 0 top
GND2  61,14 0 top
J1  7.9,12.7 270 top
J$1  84.6,10.35 90 top
JLINK  17.8,1.6 180 top
L1  45.1,21.5 0 top
L2  13.7,20.8 90 top
L3  61.8,20.1 0 top
L4  68.51,19.29 90 top
L5  470nH  [0603']  41,21.2 270 top
L6  48.7,21.5 0 top
L7  52.7,21.5 0 top
L8  200nH  [0603']  42.2,17.8 45 top
L9  18nH  [0603']  73.1,20.3 0 top
L10  22nH  [0603']  77.1,20.3 0 top
L11  53.5,18 270 top
L12  4.7uH  [0805']  13.3,11.7 270 top
L13  200nH  [0603']  42.5,7 135 top
L14  220nH  [0603']  60.3,10.8 180 top
L15  220nH  [0603']  51.1,10.8 180 top
L16  10nH  [0603']  56.5,11.6 270 top
L17  60.4,22.1 90 top
L18  56.3,20.1 0 top
L19  22nH  [0603']  79.8,18.4 270 top
NRST  16,4 0 top
R1  17.42,9.23 180 top
R2  19.67,11.63 270 top
R3  24.6,18.3 270 top
R4  66,13.4 0 top
R5  68.1,14.1 90 top
R6  20.8,1.8 90 top
R11  56.8,22.1 180 top
R12  56.7,23.4 0 top
R14  65,6 90 top
R15  52.1,2.6 90 top
R16  46.7,3.1 90 top
R19  75.7,15.2 180 top
R20  75.6,13.6 0 top
R22  40.3,22.9 180 top
R23  23.89,7.36 270 top
RX  4,9 0 top
SWCLK  13,4 0 top
SWDIO  10,4 0 top
TX  4,15 0 top
U1  17.32,11.94 0 top
U3  71.6,16.7 0 top
U5  56.49,4.31 270 top
U6  24LC01B  [SOT23-5']  23.5,2.1 0 top
U7  65.5,22.18 0 top
U8  69.62,5.52 180 top
U9  49.66,3.26 90 top
U10  81.99,3.3 0 top
U11  37.66,19.28 180 top
U12  37.61,6.68 180 top
U13  26.88,13.19 135 top
U15  79.2,12.9 180 top
V_IN  10,19 0 top
V_PA  64,17 0 top
X1  36.73,14.59 0 top
X2  36.72,1.99 0 top

### Tracks (layer width: path | path; a pad name or v marks a point on that pad's centre or on a via)
1V8  (via drill 0.25)
  Top 0.152: U9.2 51.96,3.26 R15.2 52.1,4 v51.8,4.3 | 1V8.TP 65.13,2.13 v66.43,2.13
  Top 0.254: U8.P$6 71.62,5.78 71.85,5.55 | 71.85,5.55 71.9,5.5 72.6,5.5 U8.P$3 | U8.P$19 v70.62,2.9 70.62,4.32 v70.7,4.4 71.85,5.55 | v65.4,6.7 65.3,6.8 R14.2 64.78,6.58 C13.1 59.63,6.58 C10.1 59.55,6.6 C9.1 57.79,6.55 v57.79,5.9 U5.5
  Bottom 0.152: v51.8,4.3 53.4,5.9 v57.79,5.9 | 67.8,6.7 67.4,6.3 67.4,3.1 v66.43,2.13
  Bottom 0.254: v65.4,6.7 67.8,6.7 68.4,6.7 v70.7,4.4
3.3V  (via drill 0.25)
  Top 0.152: U15.P$9 U15.P$8 v77.7,12.9 | v54.1,3.5 54.01,3.59 C8.1 | 3V3.TP v21.6,18.6 | R1.2 15.27,9.23 15.25,9.25 | 15.25,9.25 v15.2,9.3 | C12.1 14.1,7.9 C5.1 | C5.1 15.2,9.2 15.25,9.25 | C5.1 C1.1 | v27.4,3.7 26.9,3.2 C46.1 25.9,3.3 U6.4 v23.8,3.3 | R6.1 21,1.3 v21.6,1.3
  Top 0.254: C8.1 53.92,3.36 U5.3 56.36,3.36 56.4,3.4 56.4,5.26 U5.1 | R22.2 39.1,22.5 | 39.1,22.5 38.66,22.06 U11.6 | U11.8 37.66,22.36 37.8,22.5 v38.3,22.5 | v38.3,22.5 39.1,22.5 | U12.8 37.61,9.81 v37.7,9.9 | U12.6 38.61,9.79 38.5,9.9 v37.7,9.9 | R16.2 47.2,4.4 v47.3,4.4 | U13.17 26.1,16.45 v26.1,17.3 26.1,17.48 C26.1 | U13.5 30.01,10.41 C27.1 v30,10.5 | U13.1 27.75,9.85 27.75,8.98 v27.55,8.78 27.55,8.75 C28.1 | v15.2,9.3 v13.2,9.3 13.3,9.4 L12.P$2 | C17.1 37.69,10.69 | 37.69,10.69 37.7,10.68 v37.7,9.9 | C14.1 38.9,10.7 | 38.9,10.7 37.7,10.7 37.69,10.69 | C34.1 38.9,11.9 38.9,10.7 | C32.1 C16.1 C15.1 38.3,22.7 v38.3,22.5
  Layer2 0.152: JLINK.5 7.64,3.74 9.9,6 v11.6,6
  Bottom 0.152: v77.7,12.9 77.7,12.41 77.27,11.98 77.27,11.47 76,10.2 76,8.4 75.8,8.2 v73.9,8.2 | v21.6,18.6 v23.5,18.6 | v21.6,1.3 23.6,3.3 v23.8,3.3
  pour Layer2 (isolate 0.25): 11.1,28.9 74.75,28.9 74.46,7.56 64.16,7.56 63.61,7 63.7,6.91 63.7,-4.2 11.1,-4.44
  cutout Layer2: 39.1,21.7 39.1,5.8 40.2,4.7 44,4.7 48.3,9 74.12,9 74.12,23.8 41.2,23.8
!EEPROM_WRITE_EN  (via drill 0.25)
  Top 0.152: U6.5 21.85,2.6 R6.2 v19.8,2.6 | U13.3 28.6,10.41 28.6,6.9 v28.2,6.5
  Layer2 0.152: v28.2,6.5 25.3,3.6 25.3,1.3 24.46,0.46 21,0.46 19.8,1.66 v19.8,2.6
BOOT0  (via drill 0.25)
  Top 0.152: U13.31 23.89,8.43 23.89,8.1 | 23.89,8.1 R23.1 | R3.1 24.54,19.06 23.31,19.06 22.8,18.55 22.8,17.7 v23.1,17.4 | v21.1,8.7 21.7,8.1 C38.1 23.89,8.1
  Layer2 0.152: v23.1,17.4 23.1,11 21.1,9 v21.1,8.7
BOOT_CTRL
  Top 0.152: U13.18 24.6,17.24 R3.2
CS1
  Top 0.152: U11.15 33.64,18.28 29.53,14.17 U13.10
CS2  (via drill 0.25)
  Top 0.152: U12.15 33.72,5.68 32,7.4 v31.5,7.4 | v31.2,10.9 30.89,11.21 29.92,11.21 U13.6
  Bottom 0.152: v31.2,10.9 31.2,7.7 v31.5,7.4
GND  (via drill 0.25)
  other vias: 77.3,9.7 75.5,9.7 77.9,9.7 74.9,9.7 74.3,9.7 73.7,9.7 73.1,9.7 72.5,9.7 71.9,9.7 71.3,9.7 70.7,9.7 70.1,9.7 69.5,9.7 68.9,9.7 67.3,9.7 66.7,9.7 66.1,9.7 65.5,9.7 64.9,9.7 61.3,9.7 60.7,9.7 60.1,9.7 59.5,9.7 58.9,9.7 58.3,9.7 57.7,9.7 57.1,9.7 56.5,9.7 79.6,10.4 79.9,11 76.7,11.9 76.1,11.9 75.5,11.9 74.9,11.9 74.3,11.9 73.7,11.9 73.1,11.9 72.5,11.9 71.9,11.9 71.3,11.9 70.7,11.9 70.1,11.9 69.5,11.9 68.9,11.9 60.7,11.9 60.1,11.9 59.5,11.9 58.9,11.9 80.3,14.5 78.1,14.5 71.6,16.7 71.6,17.6 71.6,15.8 71,17.6 71,16.7 71,15.8 72.2,15.8 72.2,16.7 72.2,17.6 65.5,21.6 65.5,22.1 65.5,22.6 65.5,23.1 65.5,23.6 65.5,24.1 65.5,24.6 66,21.6 66,22.1 66,22.6 66,23.1 66,23.6 66,24.1 66,24.6 65,24.6 65,24.1 65,23.6 65,23.1 65,22.6 65,22.1 65,21.6 82.8,11.6 83.4,11.6 84,11.6 84.6,11.6 85.2,11.6 85.8,11.6 86.4,11.6 84,20 84,18 86,24 86,20 86,18 84,14.2 73.9,14 73.9,13.3 82,24 82,22 77,1.6 67,1 27,1 52,17 50,17 48,17 52,15 54,15 56,15 58,15 60,15 78.9,13.2 67.3,11.9 26.9,13.2 27.8,12.2 25.9,14.2 25,13.2 26.9,15.1 26.9,11.3 28.8,13.2 25.9,12.3 27.8,14.1 37.6,6.7 37.6,5.8 37.6,7.6 38.4,7.6 38.4,6.8 38.4,5.8 36.8,5.8 36.8,6.7 36.8,7.6 37.7,19.3 37.7,18.4 37.7,20.2 38.6,20.2 38.6,19.3 38.6,18.4 36.8,18.4 36.8,19.3 36.8,20.2 61.3,11.9 76.7,9.7 40,12 40,14 38,14 40,16 45,1 43,1 41,1 39,1 19,18 45,23 47,23 60,13 52.5,6.8 50.5,6.8 70.1,6.1 68,5 77,7 77,9 77,8 77,6 77,5 76,2.2 79.6,9.7 80.2,9.7 80.8,9.7 82.6,9.7 83.2,9.7 83.8,9.7 84.4,9.7 85,9.7 85.6,9.7 86.2,9.7 83.4,14.2 82.8,14.2 84.6,14.2 85.2,14.2 78.5,9.7 79.1,9.7 77,8.5 77,7.5 77,6.5 77,5.5 77,4.5 77,2.2 73,4.5 73.6,4.5 74.2,4.5 74.8,4.5 75.4,4.5 75.4,2.2 74.8,2.2 74.2,2.2 73.6,2.2 73,2.2 72.4,2.2 72.4,4.5 71.8,4.5 71.8,2.2 71.8,3.9 71.8,3.3 71.8,2.8 81.4,9.7 82,9.7 76,4.5 76.5,4.5 76.5,2.2 77,1 30.6,5.1 77.9,11.9 78.5,11.8 85.8,14.2 86.4,14.2 82.2,11.8 81,11.8 80.5,12 79.9,12.3 82.2,14 81,14 80.5,13.8 80,13.5 79.5,13.2 78.9,12.6 79.5,12.6 67.9,9.7 68.9,3.8 67.9,11.9 58.3,11.9 65.6,4.2 64.9,11.9 65.5,11.9 66.1,11.9 66.7,11.9 29,1 31,1 31,20 33,20 27,22 25,22 25,20 40,10 17.4,11.6 17.4,12.2 18.1,12.2 19.6,14.7 1,1 3,1 5,1 3,3 5,3 7,3 7,5 1,3 1,7 1,9 1,11 1,13 1,15 1,17 3,17 3,11 1,24 3,24 5,24 7,24 9,24 11,24 1,22 13,24 46,17 46,15 48,15 57.7,11.9 57.1,11.9 56.5,11.9 43.8,18.7 43.3,19.2 43.1,21.7 42.2,21.7 39.9,20.9 55.9,11.9 54.7,11.9 54.1,11.9 53.5,11.9 52.9,11.9 55.3,11.9 52.3,11.9 51.7,11.9 51.1,11.9 50.5,11.9 55.9,9.7 54.7,9.7 54.1,9.7 53.5,9.7 52.9,9.7 55.3,9.7 52.3,9.7 51.7,9.7 51.1,9.7 50.5,9.7 49.9,11.9 49.3,11.9 48.7,11.9 48.1,11.9 47.5,11.9 49.9,9.7 49.3,9.7 48.7,9.7 48.1,9.7 47.5,9.7 47,9.4 46.6,9 46.6,8.4 46.2,8 45.8,7.6 45.4,7.2 45,6.8 44.6,6.4 44.2,6 43.8,5.6 43.3,5.3 42.7,5.3 42.2,5.6 41.6,5.6 41,5.6 47.1,12.3 46.8,12.8 46.4,13.2 46,13.6 45.6,14 45.2,14.4 45.2,15 44.8,15.4 43,17.1 45,16 45.5,16.5 44.4,13.6 44.8,13.2 45.2,12.8 45.7,12.4 45.9,11.8 45.9,11.2 45.9,10.6 45.9,10 45.3,9.9 44.9,9.5 44.5,9.1 43.2,7.7 43.8,13.6 43.4,14 43,14.5 42.6,14.9 42.2,15.3 41.8,15.7 41.4,16.1 41,16.5 40.6,16.9 40.5,17.6 44.1,9.5 43.7,9.9 43.1,10 42.7,9.6 42.3,9.2 41.9,8.8 41.5,8.4 41,8 40.6,7.5 42,14 42,12 42,10 44,12 48,13 50,15 50,13 52,13 54,13 56,13 58,13 13,18 13,16 15,18 15,16 17,20 19,20 21,20 21,22 19,22 19,5 19,7 5,22 5,17 5,7 23,22 31,22 49,23 51,23 53,23 46,19 48,19 50,19 44.3,18.2 44.8,17.7 45.3,17.2 41.7,19 52,19 51,19 49,19 47,19 46,23 48,23 50,23 52,23 63,21 46,19.9 44.9,19 32,15.2 29.9,6.6 29,22 82,20 82,18 82,16 84,16 86,16 80,24 78,24 76,24 74,24 72,24 70,24 68,24 68,22 70,22 72,22 74,22 76,22 78,22 80,22 77,22 75,22 73,22 73,18.5 74,18.5 75,18.5 76,18.5 77,18.5 72,18.5 71,18.5 70,18.5 81,22 81,21 81,20 81,19 81,18 81,17 80.3,15.7 81,15 77,17.5 77,16.5 69,22 67,22 67,18.5 58,17 58,19 60,17 60,19 62,19 62,17 62,15 62,13 62,21 62,23 61.9,11.9 62.5,11.9 63.1,11.9 63.7,11.9 64.3,11.9 61.9,9.7 62.5,9.7 63.1,9.7 63.7,9.7 64.3,9.7 78.1,15.7 44,23 54.5,19 54.5,18 54.5,20 54.5,21 47,1 49,1 51,1 53,1 55,1 57,1 59,1 61,1 63,1 69,1 71,1 73,1 75,1 33,22 54.5,17 3,13
  pour Top (isolate 0.16, no thermals): -1,26 88.2,26 88.2,-0.9 -1,-0.9
  pour Bottom (isolate 0.2, no thermals): -3,28 90,28 90,-3 -3,-3
  pour Layer3 (isolate 0.2): -1.6,27 88.8,27 88.8,9.4 77.3,9.4 77.3,-2.4 -1.6,-2.4
GNSS_1PPS
  Top 0.152: U8.P$11 66.52,7.62 65.38,7.62 65,8 50.5,8 49.8,7.3 49.8,3.6 49.46,3.26 U9.5
GNSS_UART_TX
  Top 0.152: U8.P$15 66.42,3.32 61.52,3.32 60.1,1.9 R15.1 51.39,2.61 U9.1
I2C_SCL  (via drill 0.25)
  Top 0.152: U13.29 23.54,9.5 v23.4,9.5 | U6.1 22.52,0.93 v22.52,1.58
  Layer2 0.152: v23.4,9.5 23.4,4.9 22.96,4.47 22.96,2.02 v22.52,1.58
I2C_SDA  (via drill 0.25)
  Top 0.152: U13.30 24.4,9.65 v24.4,9.6 | U6.3 24.4,0.95 v24.4,1.9
  Layer2 0.152: v24.4,9.6 v24.4,1.9
MCU_GNSS_1PPS  (via drill 0.25)
  Top 0.152: U13.8 29.96,12.66 30.6,13.3 31.2,13.3 31.86,12.64 31.86,9.63 30.9,8.67 30.9,5.7 v31.4,5.2 | v50.6,5.2 50.64,5.16 50.46,4.98 U9.3
  Layer2 0.152: v50.6,5.2 45.3,5.2 v44.2,4.1
  Bottom 0.152: v44.2,4.1 44.2,3.1 43.12,2.02 42.18,2.02 41.6,2.6 33,2.6 31.4,4.2 v31.4,5.2
MCU_GNSS_UART_RX  (via drill 0.25)
  Top 0.152: U13.9 30.48,14.32 30.88,14.32 32.4,12.8 v32.4,8 | v42.8,2.8 46.3,2.8 R16.1 46.91,2.61 U9.6 | v32.1,6.3 32.1,5 32.4,4.7 v34.5,4.7
  Bottom 0.152: v42.8,2.8 42.6,2.8 40.7,4.7 v34.5,4.7 | v32.4,8 32.4,6.9 32.1,6.6 v32.1,6.3
MCU_UART_RX  (via drill 0.25)
  Top 0.152: U13.20 24.36,16.06 22.06,16.06 v21.5,15.5 | RX.TP 6.43,11.43 J1.3
  Bottom 0.152: v21.5,15.5 19.7,13.7 10.17,13.7 J1.3
MCU_UART_TX  (via drill 0.25)
  Top 0.152: U13.19 24.63,16.5 21.6,16.5 v21.5,16.4 | J1.2 7.87,14 5,14 TX.TP
  Bottom 0.152: v21.5,16.4 20.3,15.2 9.13,15.2 J1.2
MISO  (via drill 0.25)
  Top 0.152: U11.13 33.82,19.28 v33.8,19.3 | v32.4,19.3 31,17.9 31,16.96 U13.12 | U12.13 34.12,6.68 33.5,7.3 33.5,16.74 v33.8,17.04
  Layer2 0.152: v32.4,19.3 v33.8,19.3 v33.8,17.04
MOSI  (via drill 0.25)
  Top 0.152: U11.14 33.18,18.78 v33.15,18.75 | U13.13 30.4,17.06 30.4,18.1 v31.1,18.8 | U12.14 33.82,6.18 33,7 33,16.94 v33.1,17.04
  Layer2 0.152: v31.1,18.8 33.1,18.8 v33.15,18.75 33.1,18.7 v33.1,17.04
N$1
  Top 0.254: 17.4,13.17 U1.5
  Top 0.406: 17.4,13.17 C3.1 17.4,17.4 15.5,19.3 L2.P$1 | U1.5 U1.4
N$2
  Top 0.254: D1.C 16.37,14.12 U1.6 15.39,13.09 C2.2 14.8,12.7 L12.P$1
N$3
  Top 0.127: C19.2 44.3,16.83 L8.2 41.33,18.37 40.42,19.28 U11.3
N$4
  Top 0.254: C2.1 16.06,11.1 U1.1
N$5
  Top 0.152: R1.1 18.27,9.38 U1.3
  Top 0.254: U1.3 19.63,10.79 R2.2
N$6
  Top 0.127: U11.2 40.23,18.78 L8.1 42.91,16.11 C18.1
N$7
  Top 1.016: L6.P$2 C24.1 L7.P$1
N$8
  Top 0.254: R12.2 R11.1 C11.1 59.7,22.9 L17.P$2
N$9
  Top 0.254: U3.P$2 69.6,16.7 69.2,16.3 69.2,13.8 68.8,13.4 R5.1 R4.2
N$10
  Top 0.152: U10.P$1 78.57,3.52 U8.P$1
N$11
  Top 1.016: L7.P$2 C25.1 L11.P$1
N$12
  Top 1.016: L1.P$2 C23.1 L6.P$1
N$13
  Top 0.254: R14.1 65.22,5.52 U8.P$13
N$14
  Top 0.152: R19.1 R20.2 77,13.6 77.2,13.4 U15.P$7
N$15
  Top 0.406: U15.P$2 80.6,12.9
  Top 0.61: 80.6,12.9 81.1,12.9
  Top 1.2: J$1.SIG 81.1,12.9
N$16
  Top 0.152: X2.1 35.84,1.19 36.61,1.96 U12.16
N$17
  Top 0.152: U12.17 37.11,3.5 X2.3
N$18
  Top 0.152: X1.1 35.75,13.79 36.66,14.7 U11.16
N$19
  Top 0.152: U11.17 37.16,16.06 X1.3
N$20
  Top 0.127: U12.2 42.67,6.18 L13.1 43.3,6.5 C20.1
N$21
  Top 0.127: U12.3 41.05,6.68 L13.2 43.3,8.93 C31.2
N$22
  Top 0.61: D2.C 7.33,22.7 F1.1
N$23
  Top 0.61: L4.2 | 69.8,20.19 C37.1
  Top 1: U7.3 L4.2 | L4.2 69.8,20.19 | C37.1 C39.1 L9.1
N$24
  Top 0.254: U11.4 40.91,19.78 41,19.87 L5.2
  Top 1.016: L5.2 41.1,20.3 C22.P$1
N$26
  Top 1.016: L3.P$2 63.9,20.1 U7.1
N$28
  Top 1: L9.2 C36.1 L10.1
N$29
  Top 1.016: C29.2 55.5,16.4 C43.1 C45.1 L18.P$1
N$30
  Top 0.406: C21.1 R22.1 L5.1
N$31
  Top 1.016: L1.P$1 C22.P$2
N$32
  Top 1.016: L18.P$2 C30.1 C41.1 60.3,20.1 | 60.3,20.1 L3.P$1 | L17.P$1 60.4,20.2 60.3,20.1
N$34
  Top 1.016: C47.2 79.1,17.5 | 79.1,17.5 L19.2 | C44.1 79.17,17.43 79.1,17.5
N$37
  Top 0.508: C40.2 C33.2 L16.2 C35.1
N$38
  Top 0.508: L15.1 C40.1
N$39
  Top 0.508: C35.2 L14.2
N$43
  Top 0.406: L10.2 78.1,20.5 C42.1 79.1,19.1
  Top 1.016: L19.1 79.1,19.1 C47.1
NRST  (via drill 0.25)
  Top 0.152: U13.4 29.1,10.62 29.1,6.7 27.2,4.8 21.4,4.8 v21.2,4.6 | v19.3,4 NRST.TP v15.16,3.16
  Bottom 0.152: v19.3,4 19.9,4.6 v21.2,4.6 | v15.16,3.16 15.16,1.7 JLINK.2
PA_IN
  Top 1.016: L11.P$2 53.5,16.1 C29.1
PA_OUT
  Top 0.406: C44.2 79.2,14.98 U15.P$5
RF_IN
  Top 0.406: U15.P$11 79.2,11.2 arc-90 78.8,10.8 78.2,10.8
  Top 1.2: L14.1 78.2,10.8
RX_EN  (via drill 0.25)
  Top 0.152: v48.3,8 48.87,8 49.37,8.51 65.31,8.51 v65.5,8.7 | 27.79,10.54 28.21,10.12 28.21,7.71 25.8,5.3 v25.6,5.3 | v72.4,13.4 72.4,13.5 74.1,15.2 R19.2
  Top 0.254: U13.2 27.79,10.54
  Bottom 0.152: v65.5,8.7 67.9,8.7 68.44,9.24 68.44,12.19 68.81,12.56 71.56,12.56 v72.4,13.4 | v25.6,5.3 25.6,4 27.95,1.65 48.75,1.65 49.5,2.4 49.5,6.9 48.4,8 v48.3,8
RX_IC_CLK  (via drill 0.25)
  Top 0.152: U13.26 22.88,10.96 v21.7,10.96 | v23.42,4.28 23.52,4.38 33.12,4.38 v33.5,4 | U12.20 v38.61,3.91 v38.6,3.9 | v21.4,6.4 21.4,5.9 21.9,5.4 22.8,5.4 v22.9,5.3
  Bottom 0.152: v38.6,3.9 33.6,3.9 v33.5,4 | v21.7,10.96 21.7,6.7 v21.4,6.4 | v22.9,5.3 23.42,4.78 v23.42,4.28
RX_IC_DATA  (via drill 0.25)
  Top 0.152: U13.27 23.13,10.5 v21.2,10.5 | U12.10 35.43,8.73 v35,8.3
  Bottom 0.152: v35,8.3 35,7.4 33.36,5.76 20.84,5.76 20.4,6.2 20.4,9.7 v21.2,10.5
RX_IN
  Top 0.127: C18.2 46.5,12.3 46.5,10.8 | C20.2 46.5,9.7 46.5,10.8 | 47.1,10.8 46.5,10.8
  Top 1.2: L15.2 47.1,10.8
SCK  (via drill 0.25)
  Top 0.152: U12.12 34.42,7.18 34.1,7.5 34.1,16.69 v34.41,17 | U13.11 32.18,17.43 32.18,18.43 33.55,19.8 v34.6,19.8 34.62,19.78 U11.12
  Layer2 0.152: v34.41,17 34.41,19.61 v34.6,19.8
SDN1  (via drill 0.25)
  Top 0.152: U13.14 29.7,17.07 v29.7,17.5 | U11.1 39.71,17.71 v39.5,17.5
  Bottom 0.152: v29.7,17.5 v39.5,17.5
SDN2  (via drill 0.25)
  Top 0.152: U13.25 22.82,11.6 21.5,11.6 20.4,10.5 20.4,4.5 v21.07,3.83 | U12.1 39.66,3.96 v39.6,3.9 | v27.2,1.7 28.1,1.7 29.7,3.3 v33.6,3.3
  Bottom 0.152: v33.6,3.3 39,3.3 v39.6,3.9 | v21.07,3.83 23.23,3.83 23.23,3.82 25.08,3.82 v27.2,1.7
SWCLK  (via drill 0.25)
  Top 0.152: U13.24 22.45,12.3 v21.6,12.3 | SWCLK.TP 13.5,4.5 v14.2,4.5 14.2,3.68 v13.3,2.78
  Bottom 0.152: v21.6,12.3 21.6,11.9 v14.2,4.5 | v13.3,2.78 12.72,2.2 JLINK.3
SWDIO  (via drill 0.25)
  Top 0.152: U13.23 23.6,14.7 21.7,14.7 v21.5,14.5 | v10,5.3 SWDIO.TP 10,3.7 v10.78,2.92
  Bottom 0.152: v21.5,14.5 21.5,13 17,8.5 13.2,8.5 v10,5.3 | v10.78,2.92 10.78,2.2 JLINK.4
TRX_IC_CLOCK  (via drill 0.25)
  Top 0.152: U13.7 30.14,11.7 30.74,11.7 30.8,11.76 v30.8,12.16 | U11.19 38.16,16.46 v38.1,16.4
  Bottom 0.152: v38.1,16.4 34.84,16.4 30.8,12.36 v30.8,12.16
TRX_IC_DATA
  Top 0.152: U13.15 29.2,17.28 29.2,19.1 31.43,21.33 U11.10
TX_CTRL  (via drill 0.25)
  Top 0.254: v22.8,9.8 23.1,10.1 23.44,10.1 U13.28 | R11.2 55.1,22.1 54.4,22.8 v54.4,23.4
  Bottom 0.152: 38.93,21.3 38.8,21.17 | 36.51,21.17 36.48,21.2
  Bottom 0.254: v22.8,9.8 22.3,10.3 22.3,15.2 28.3,21.2 36.48,21.2 | 38.8,21.17 36.51,21.17 | 38.93,21.3 38.93,22.55 40.18,23.8 54,23.8 v54.4,23.4
V_BAT  (via drill 0.25)
  Top 0.406: U3.P$6 73.1,17.2 | 73.1,17.2 U3.P$5 | C6.1 73.17,17.27 73.1,17.2
  Top 0.61: v17.8,23.2 16.74,22.14 C4.1 15.9,21.5 15.5,21.9 14.1,21.9 L2.P$2 13.6,22.4 12.02,22.4 F1.2
  Layer2 0.61: v17.8,23.2 19,24.4 v55.7,24.4
  Bottom 0.61: C6.1 74.26,16.63 72.53,14.9 64.14,14.9 64.14,22.06 61.8,24.4 v55.7,24.4
  other vias: 74.46,17.27
V_IN  (via drill 0.25)
  Top 0.61: J1.1 6.8,17.61 D2.A 6.83,19 v7.7,19 V_IN.TP
V_PA  (via drill 0.25)
  Top 0.254: 68.1,15.8 R5.2 | v65.3,17 V_PA.TP
  Top 0.508: U3.P$1 68.57,17.65 L4.1 68.5,17.7
  Top 0.61: 68.1,15.8 68.1,15.9 C7.1 v67.8,16.9 67.8,17 68.5,17.7
  Bottom 0.254: v67.8,16.9 65.4,16.9 v65.3,17
(copper drawn outside any net)
  shapes: Top area x15

### Text on the board
tNames: AIS Transponder / Class B / Rev 5.2 / (c)2016-2020 / P. Antypas | VDD | SWDIO | SWCLK | NRST | GND
bNames: JLCJLCJLCJLC